# EAGLE board soundcard v1.1 (EAGLE 6.5.0), part 1 of 2
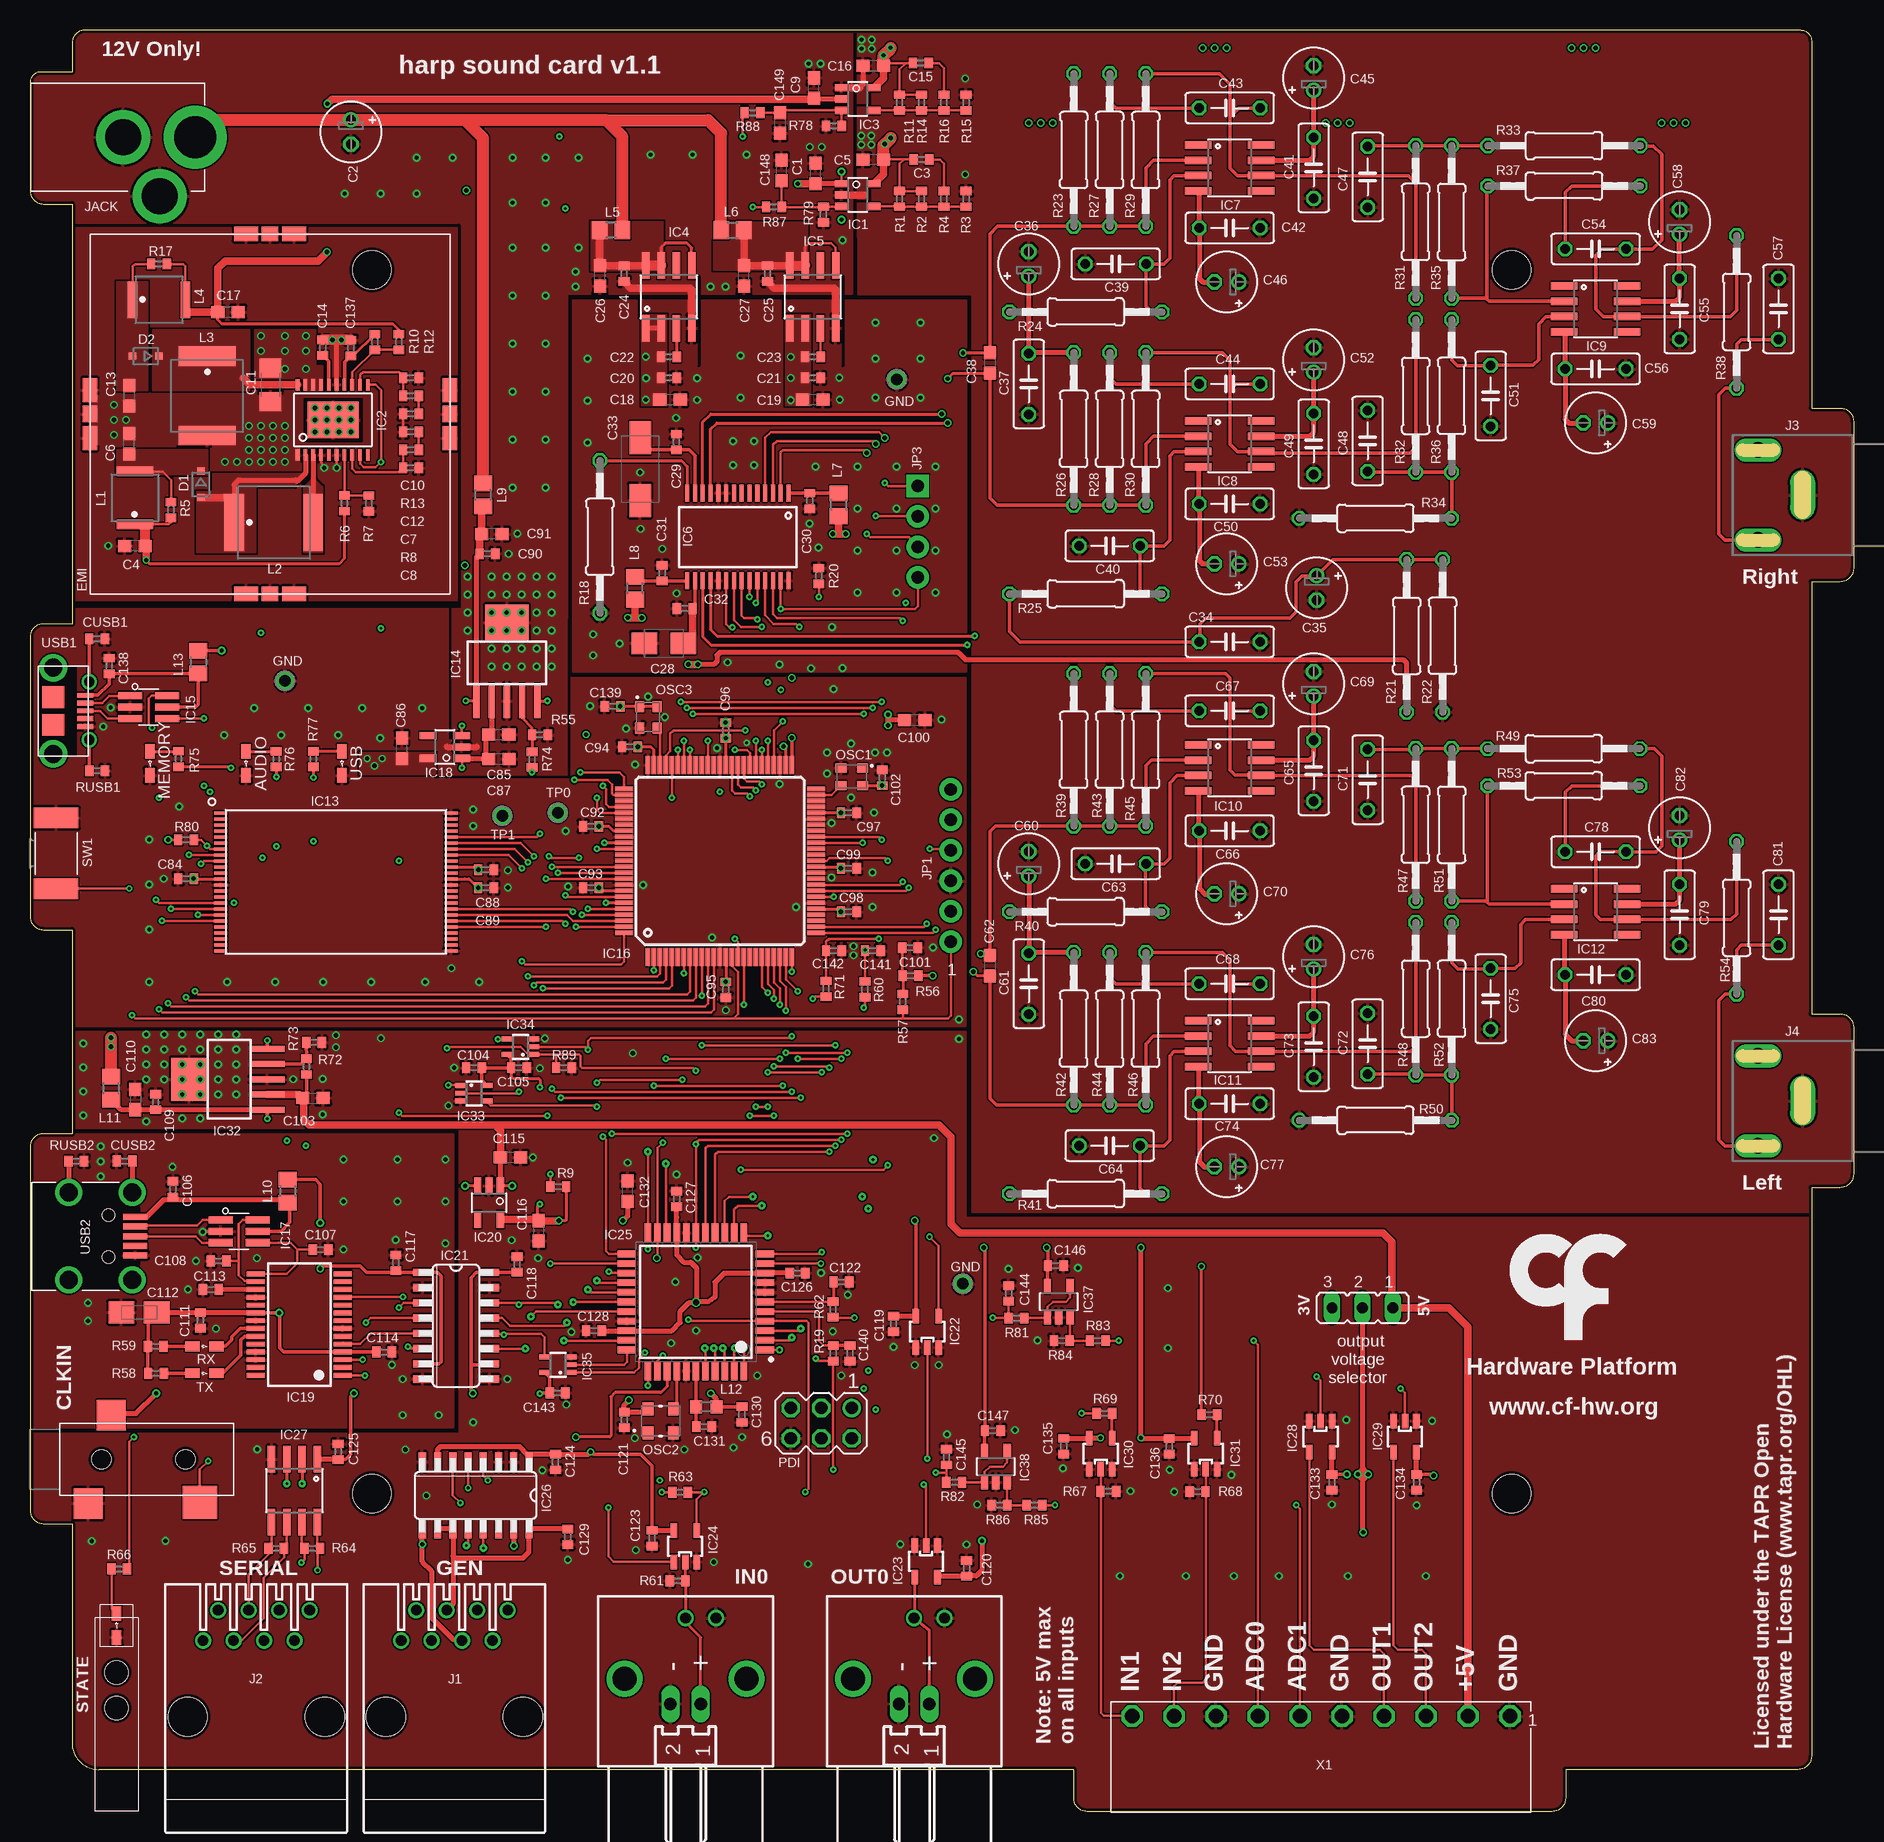
[diagram p8: board, top side]
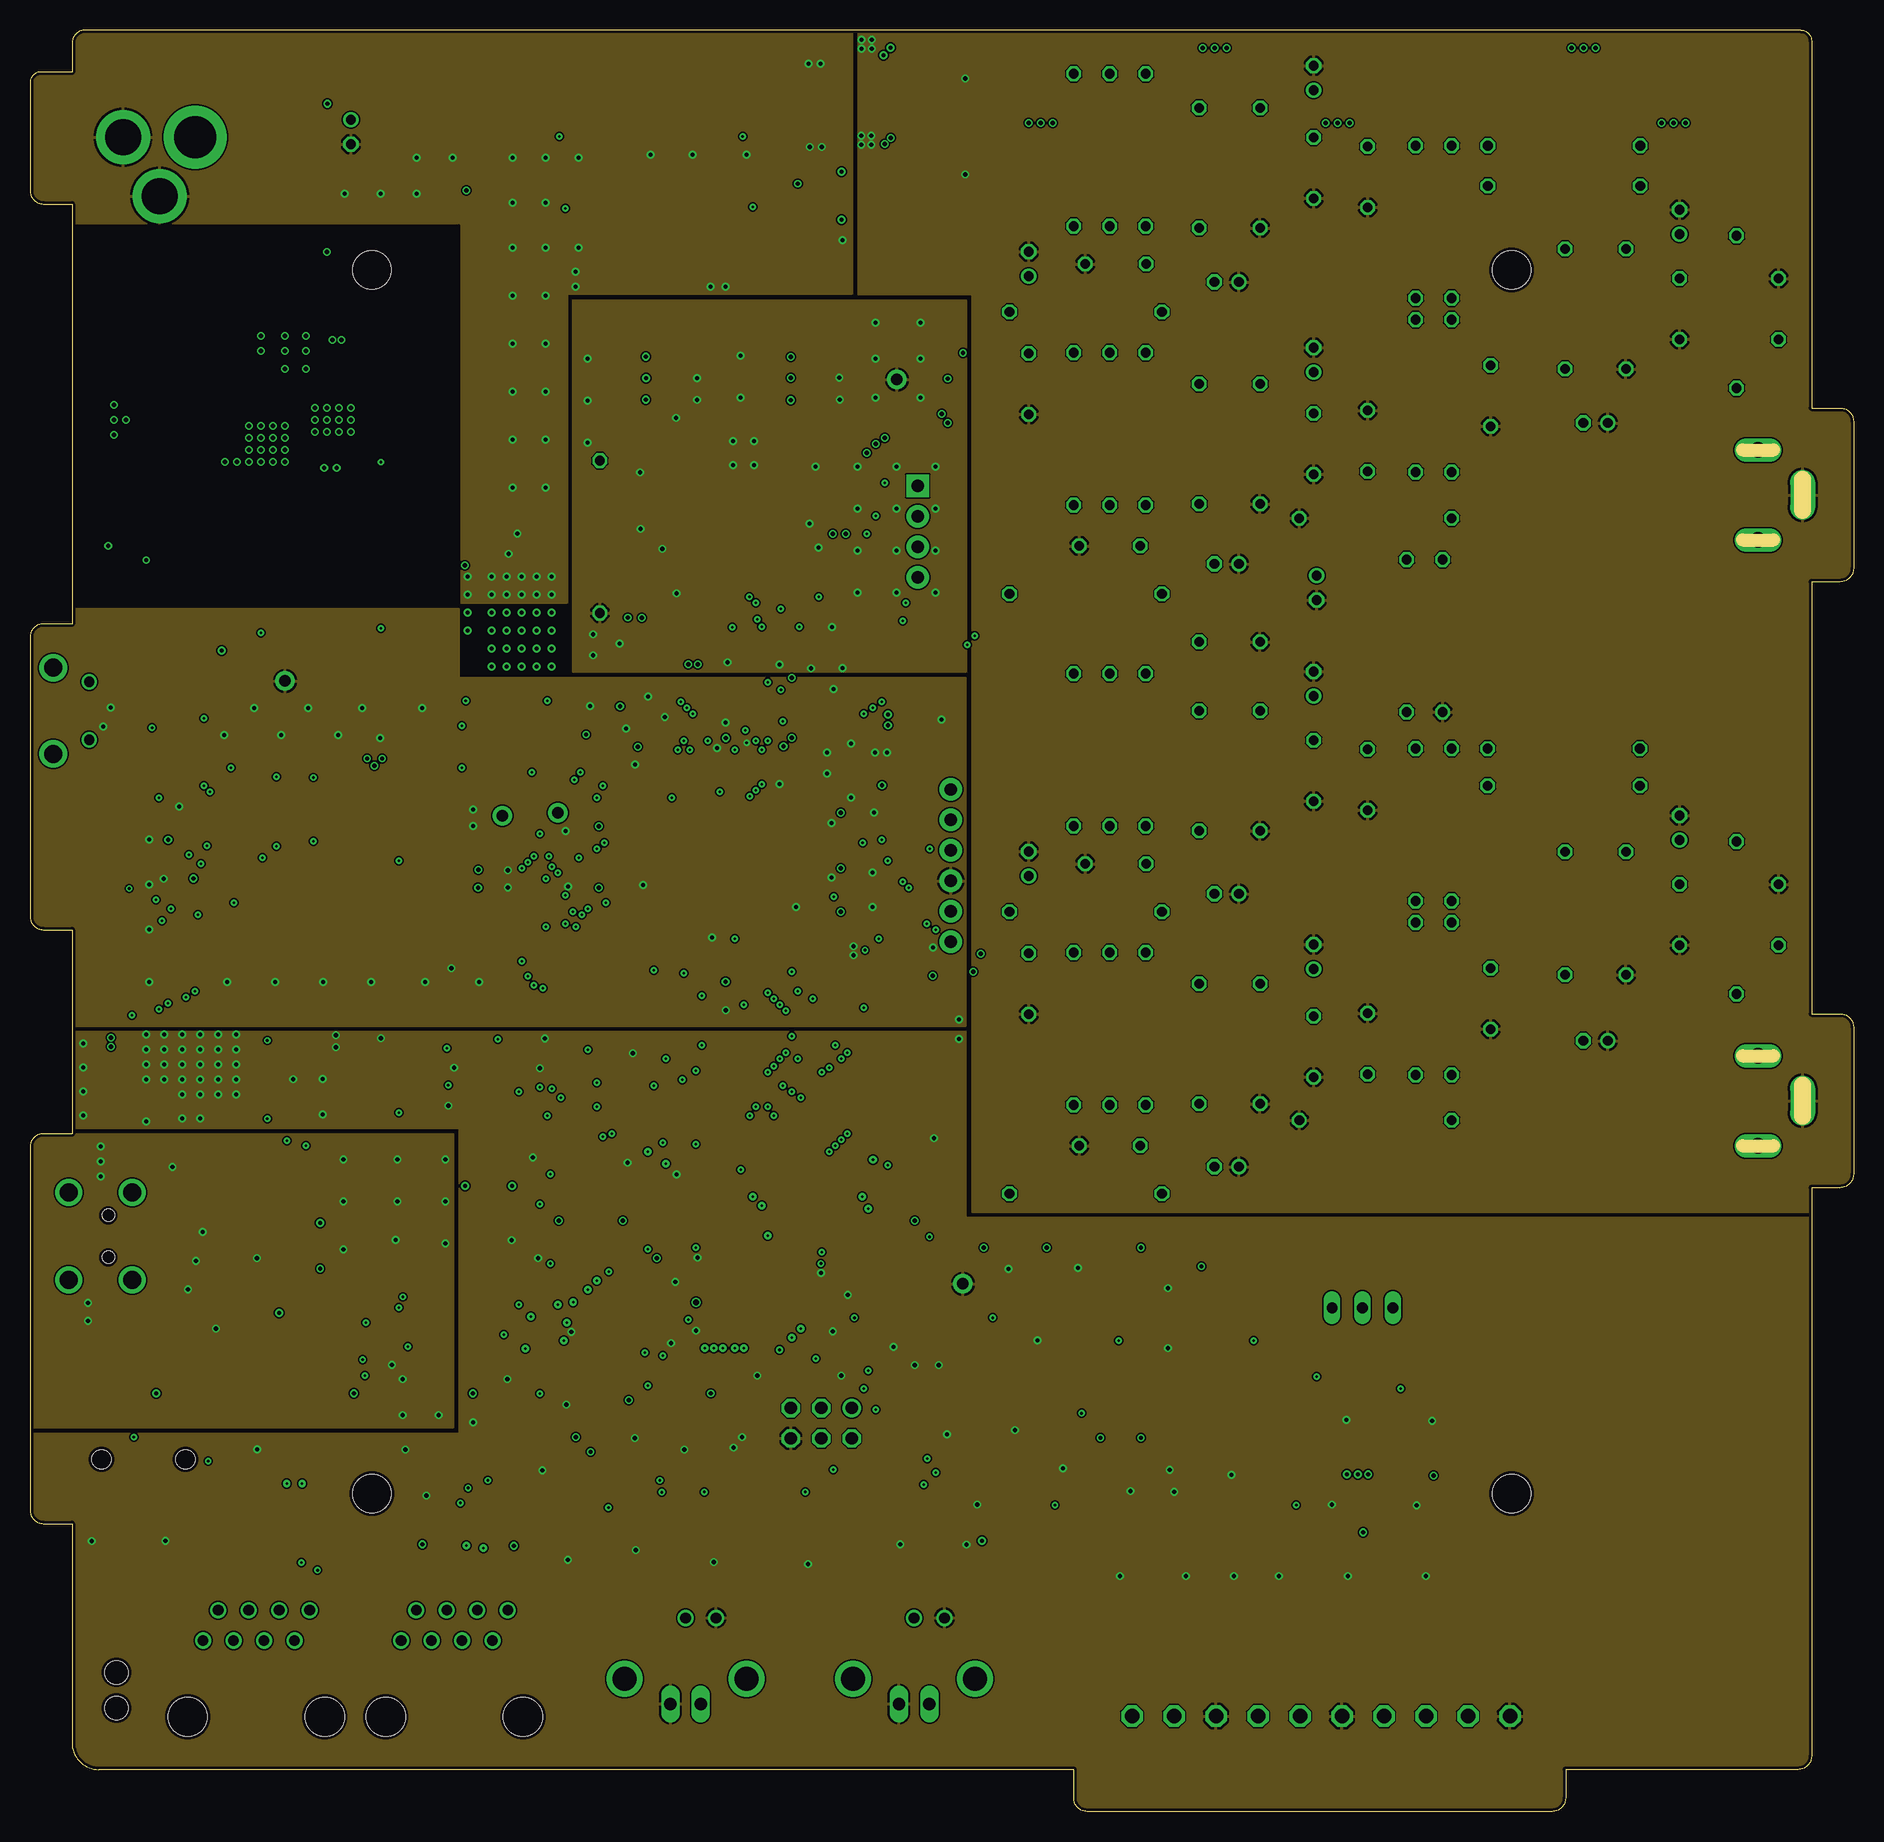
[diagram p9: board, inner layer Route2]
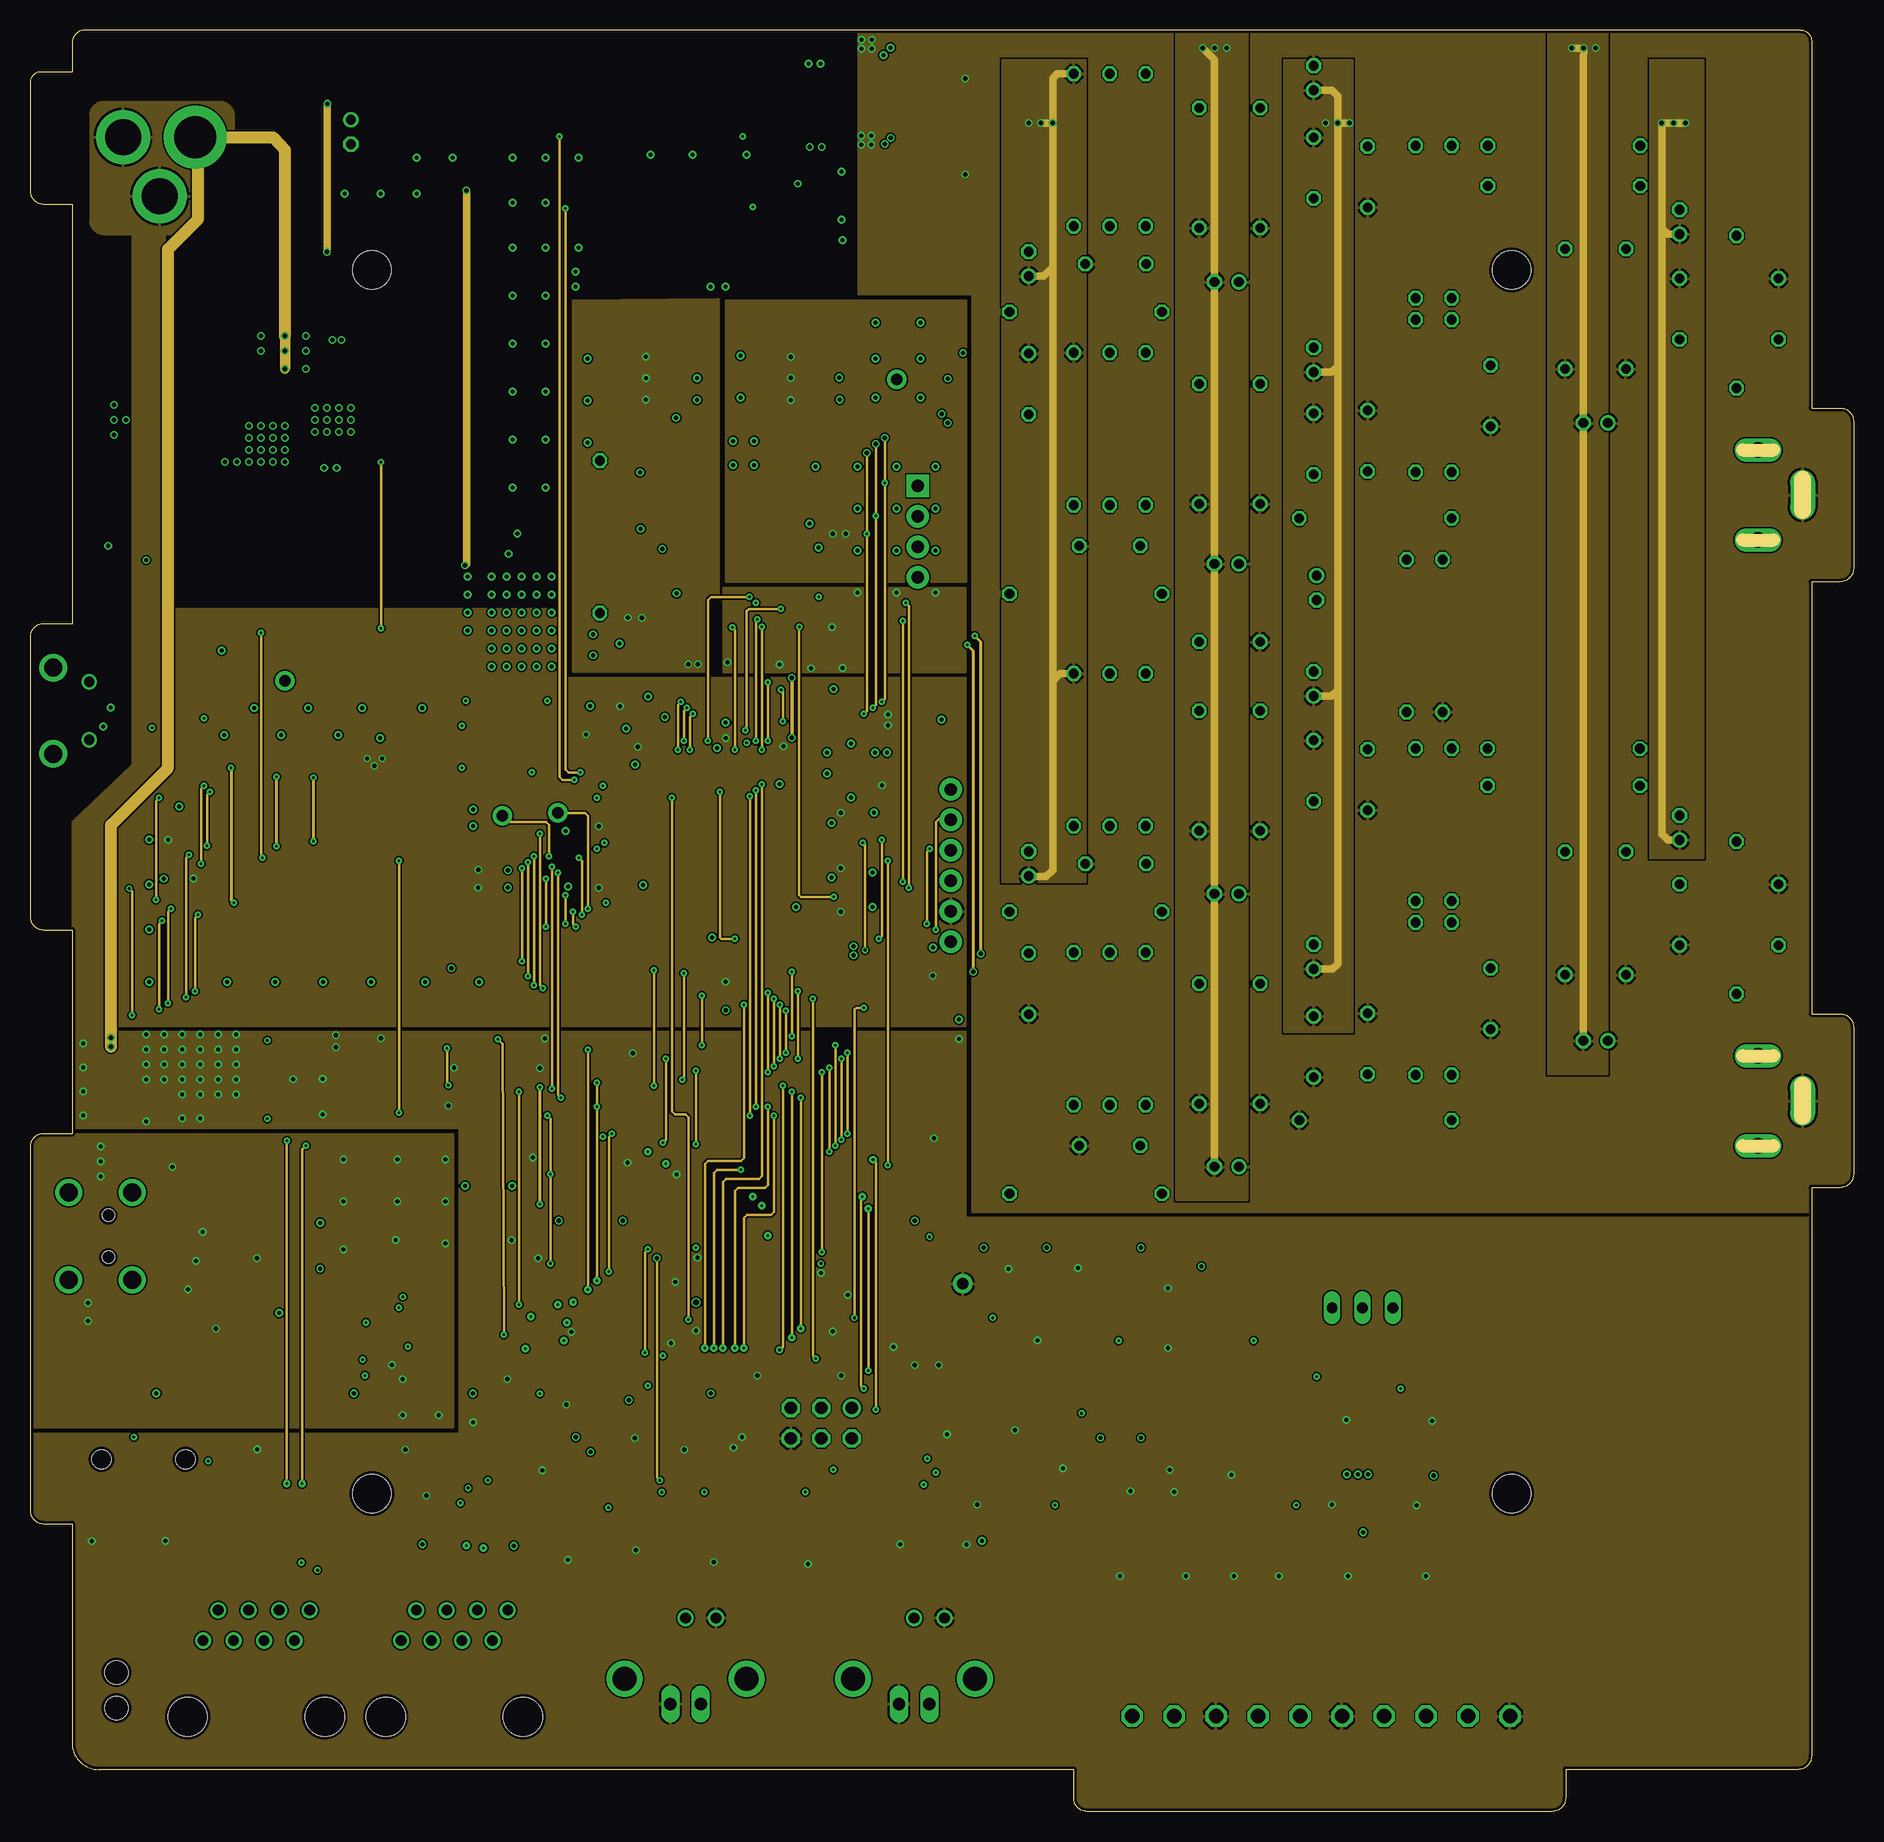
[diagram p10: board, inner layer Route3]
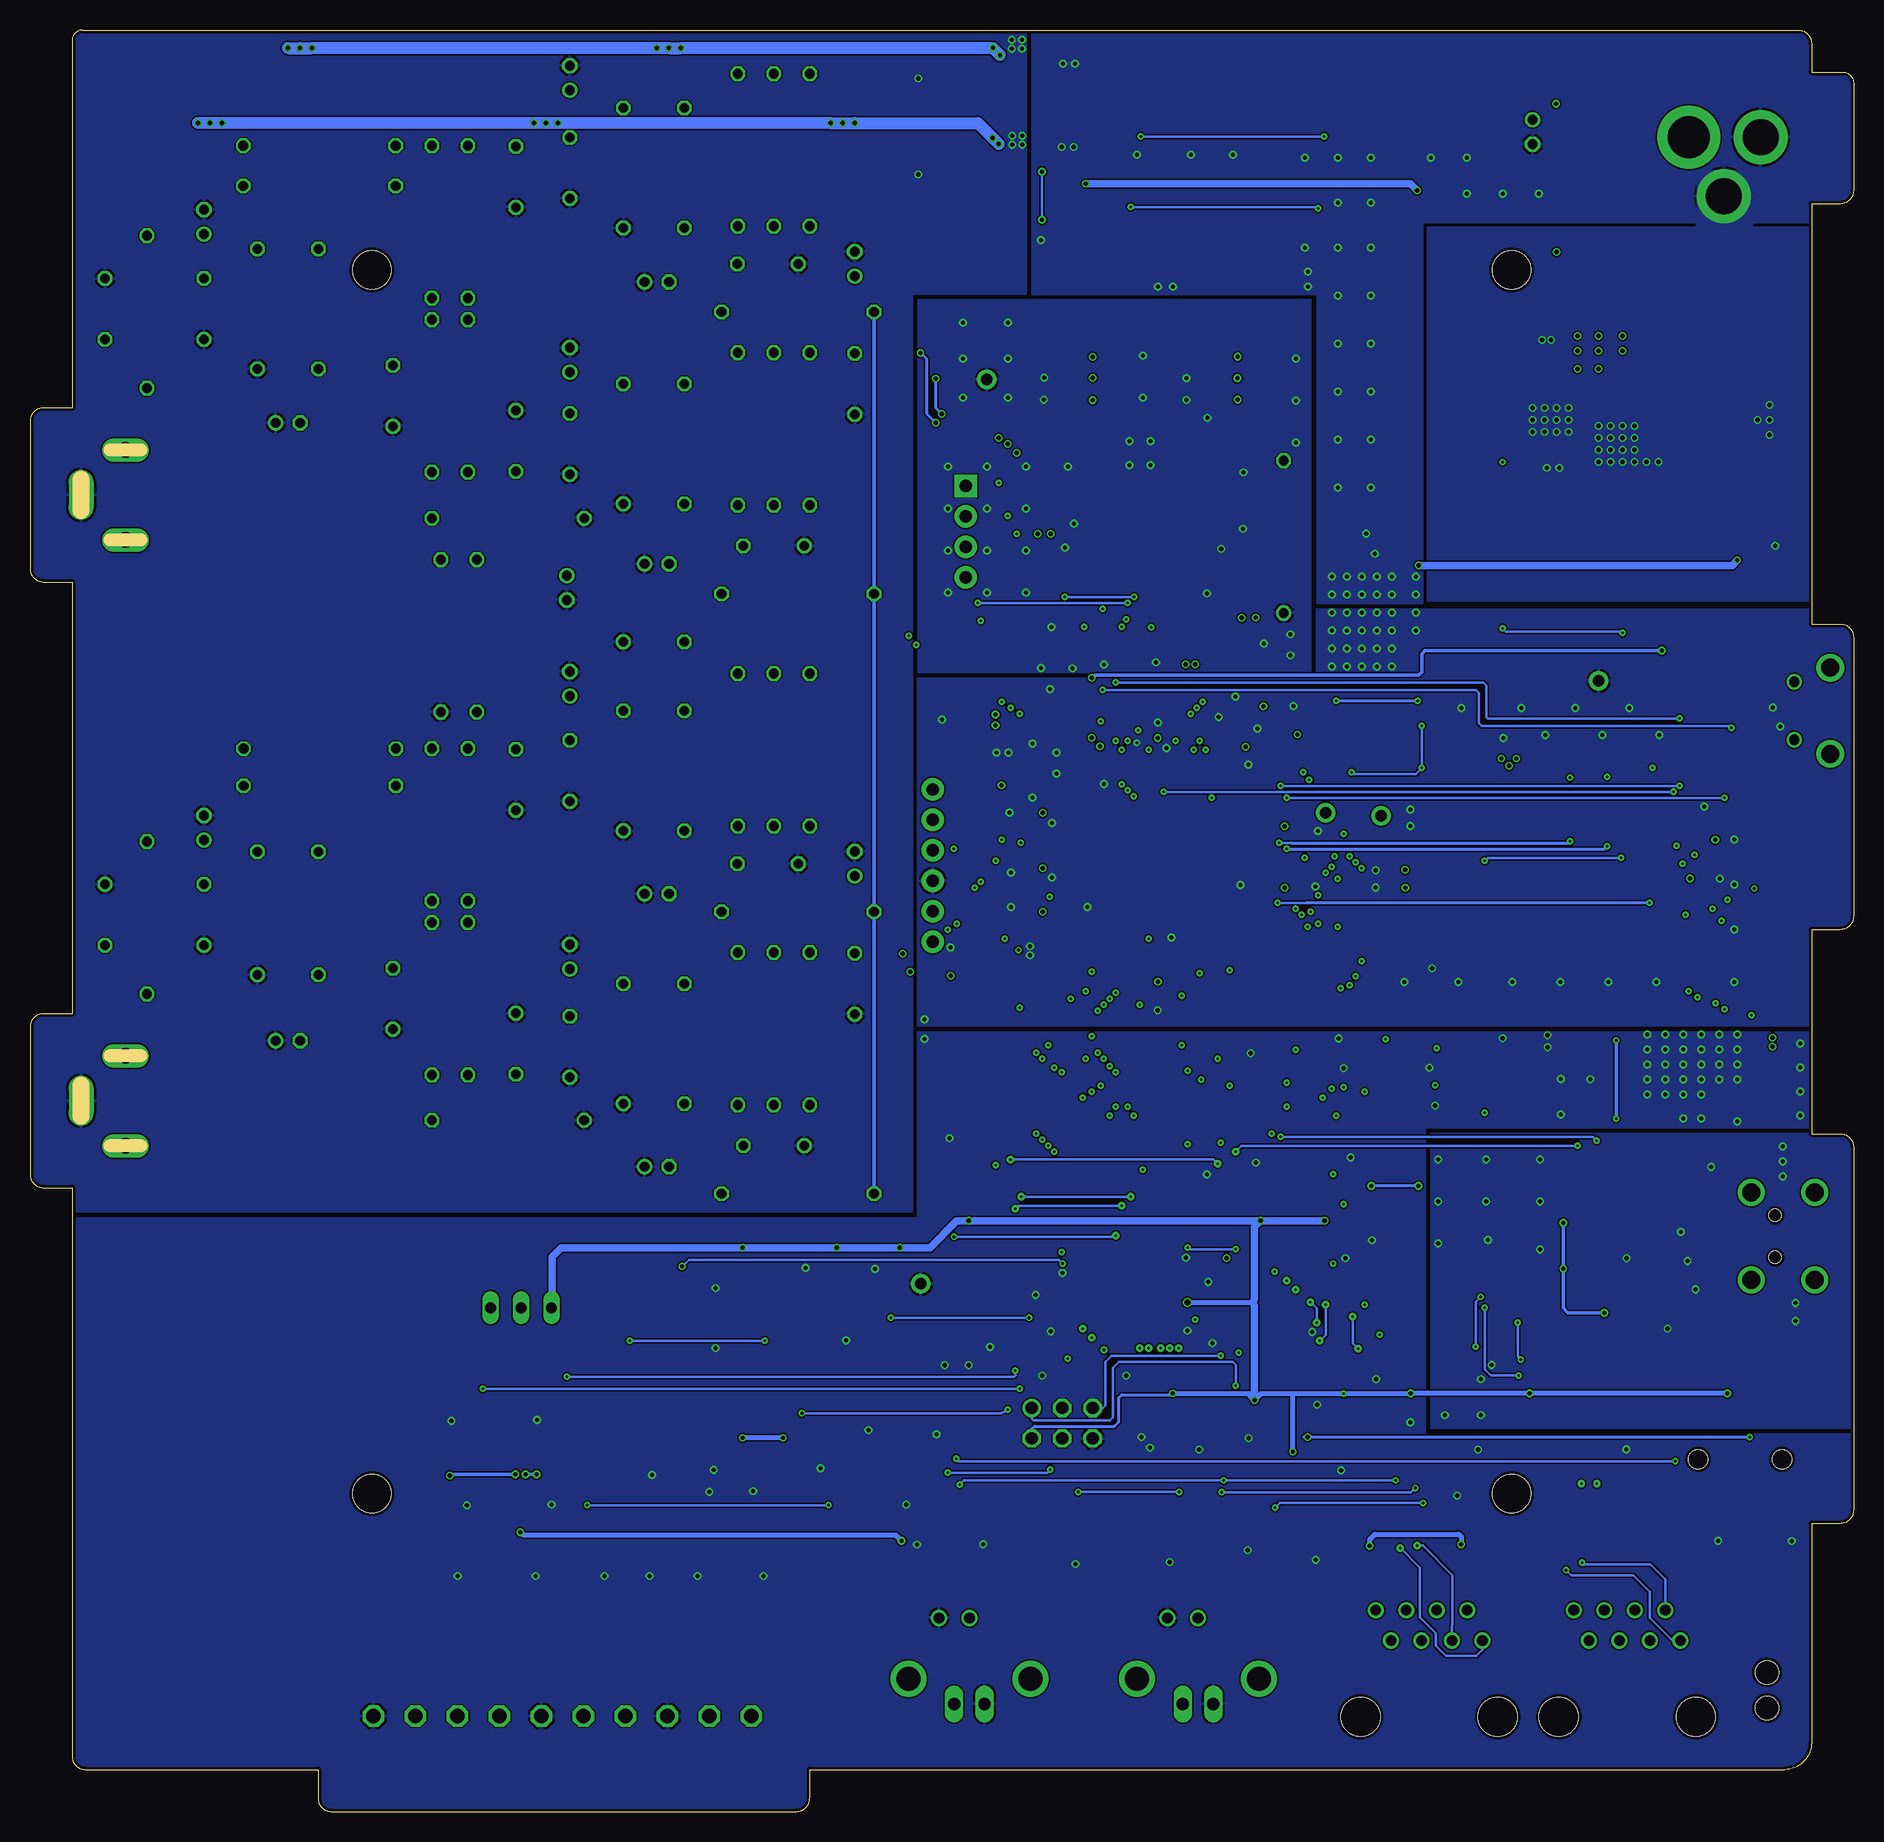
[diagram p11: board, bottom side, seen from below]

Size 152 x 148.5 mm. Coordinates in mm from the lower left corner, seen from the top.
Outline: 3.5,56.5 1.12,56.5 arc90 0,55.38 0,25.12 arc90 1.12,24 3.5,24 3.5,5.74 arc90 5.74,3.5 87,3.5 87,1.12 arc90 88.12,0 126.88,0 arc90 128,1.12 128,3.5 147.38,3.5 arc90 148.5,4.62 148.5,52 150.88,52 arc90 152,53.12 152,65.38 arc90 150.88,66.5 148.5,66.5 148.5,102.5 150.88,102.5 arc90 152,103.62 152,115.88 arc90 150.88,117 148.5,117 148.5,147.6 arc90 147.6,148.5 4.62,148.5 arc90 3.5,147.38 3.5,145 0.9,145 arc90 0,144.1 0,135.12 arc90 1.12,134 3.5,134 3.5,99 1.12,99 arc90 0,97.88 0,74.62 arc90 1.12,73.5 3.5,73.5 3.5,56.5
Copper layers (1+2*3+16): Top 0.018mm / dielectric 0.36mm / Route2 0.035mm / dielectric 0.71mm / Route3 0.035mm / dielectric 0.36mm / Bottom 0.018mm
Design rules "eC_4Layer_PClass7_BaseCopperO18-I35 *": minimum track width 0.125mm, minimum drill 0.15mm, track to track 0.125mm, track to pad 0.125mm, pad to pad 0.125mm, via to via 0.125mm, smd to smd 0mil, copper to edge 0.25mm, drill to drill 0.35mm, minimum pad ring 0.175mm, minimum via ring 0.125mm, stop-mask expansion 0mil, vias tented up to drill 0.45mm, thermal gap 0.2mm
Holes 3.2 mm at 28.5,26.5 123.5,26.5 28.5,128.5 123.5,128.5
tRestrict: 19 lines
bRestrict: 6 lines

## Footprints (pad centres in the part's own frame; a part is rotated, then mirrored left to right if it is on the bottom)
C0603 = smd 1.1 x 1: 1 -0.85,0; 2 0.85,0
E2-5 = drill 0.813 pad 1.27: + -1.016,0 | drill 0.813 pad 1.27 octagon: - 1.016,0
C0402 = smd 0.7 x 0.9: 1 -0.65,0; 2 0.65,0
C1206 = smd 1.6 x 1.8: 1 -1.4,0; 2 1.4,0
B/3528-21W = smd 2.15 x 1.8: + 1.625,0; - -1.625,0
C/6032-28W = smd 2.75 x 1.8: + 2.625,0; - -2.625,0
C050-025X075 = drill 0.813 octagon: 1 -2.54,0; 2 2.54,0
A/3216-18W = smd 2.15 x 1.8: + 1.475,0; - -1.475,0
35RASMT2BHNTRX = smd 2.4 x 2.55: 1 0.8,3.675; 5 -1.1,-3.675 | smd 2.9 x 2.75: 4 8.2,-3.575 | hole 1.6: 0,0; 7,0
SOD323-R = smd 0.6 x 0.6: A 1.1,0; C -1.1,0
S01-30300500 = smd 1.4 x 1.2: P$1 0,15; P$7 0,-15 | smd 1.2 x 1.4: P$2 -15,0; P$3 15,0 | smd 2 x 1.2: P$4 2,-15; P$5 -2,-15; P$6 2,15; P$8 -2,15 | smd 1.2 x 2: P$9 -15,2; P$10 -15,-2; P$11 15,2; P$12 15,-2
TP_1 = drill 0.925 pad 1.6: TP 0,0
TSOT23-5 = smd 0.6 x 1.05: 1 -0.95,-1.354; 2 0,-1.354; 3 0.95,-1.354; 4 0.95,1.354; 5 -0.95,1.354
TSSOP-EP-20 = smd 0.305 x 0.991: 1 -2.94,-2.918; 2 -2.29,-2.918; 3 -1.64,-2.918; 4 -0.99,-2.918; 5 -0.34,-2.918; 6 0.31,-2.918; 7 0.96,-2.918; 8 1.61,-2.918; 9 2.26,-2.918; 10 2.91,-2.918; 11 2.91,2.918; 12 2.26,2.918; 13 1.61,2.918; 14 0.96,2.918; 15 0.31,2.918; 16 -0.34,2.918; 17 -0.99,2.918; 18 -1.64,2.918; 19 -2.29,2.918; 20 -2.94,2.918 | smd 4.25 x 3.05: EPAD 0,0
SO08 = smd 0.61 x 2.21: 1 -1.905,-2.616; 2 -0.635,-2.616; 3 0.635,-2.616; 4 1.905,-2.616; 5 1.905,2.616; 6 0.635,2.616; 7 -0.635,2.616; 8 -1.905,2.616
SSOP28 = smd 0.348 x 1.397: P1 -4.225,-3.656; P2 -3.575,-3.656; P3 -2.925,-3.656; P4 -2.275,-3.656; P5 -1.625,-3.656; P6 -0.975,-3.656; P7 -0.325,-3.656; P8 0.325,-3.656; P9 0.975,-3.656; P10 1.625,-3.656; P11 2.275,-3.656; P12 2.925,-3.656; P13 3.575,-3.656; P14 4.225,-3.656; P15 4.225,3.656; P16 3.575,3.656; P17 2.925,3.656; P18 2.275,3.656; P19 1.625,3.656; P20 0.975,3.656; P21 0.325,3.656; P22 -0.325,3.656; P23 -0.975,3.656; P24 -1.625,3.656; P25 -2.275,3.656; P26 -2.925,3.656; P27 -3.575,3.656; P28 -4.225,3.656
TSOP-48 = smd 0.25 x 1.1: P1 -5.75,-9.6; P2 -5.25,-9.6; P3 -4.75,-9.6; P4 -4.25,-9.6; P5 -3.75,-9.6; P6 -3.25,-9.6; P7 -2.75,-9.6; P8 -2.25,-9.6; P9 -1.75,-9.6; P10 -1.25,-9.6; P11 -0.75,-9.6; P12 -0.25,-9.6; P13 0.25,-9.6; P14 0.75,-9.6; P15 1.25,-9.6; P16 1.75,-9.6; P17 2.25,-9.6; P18 2.75,-9.6; P19 3.25,-9.6; P20 3.75,-9.6; P21 4.25,-9.6; P22 4.75,-9.6; P23 5.25,-9.6; P24 5.75,-9.6; P25 5.75,9.6; P26 5.25,9.6; P27 4.75,9.6; P28 4.25,9.6; P29 3.75,9.6; P30 3.25,9.6; P31 2.75,9.6; P32 2.25,9.6; P33 1.75,9.6; P34 1.25,9.6; P35 0.75,9.6; P36 0.25,9.6; P37 -0.25,9.6; P38 -0.75,9.6; P39 -1.25,9.6; P40 -1.75,9.6; P41 -2.25,9.6; P42 -2.75,9.6; P43 -3.25,9.6; P44 -3.75,9.6; P45 -4.25,9.6; P46 -4.75,9.6; P47 -5.25,9.6; P48 -5.75,9.6
SOT223-6 = smd 0.508 x 2.87: P$1 -2.54,-3.175; P$2 -1.27,-3.175; P$3 0,-3.175; P$4 1.27,-3.175; P$5 2.54,-3.175 | smd 3.6 x 2.962: P$6 0,3.353
SOT23-6L = smd 0.6 x 2: P$1 -0.95,-1.55; P$2 0,-1.55; P$3 0.95,-1.55; P$4 0.95,1.55; P$5 0,1.55; P$6 -0.95,1.55
TQFP-100 = smd 1.5 x 0.35: 1 -8,6; 2 -8,5.5; 3 -8,5; 4 -8,4.5; 5 -8,4; 6 -8,3.5; 7 -8,3; 8 -8,2.5; 9 -8,2; 10 -8,1.5; 11 -8,1; 12 -8,0.5; 13 -8,0; 14 -8,-0.5; 15 -8,-1; 16 -8,-1.5; 17 -8,-2; 18 -8,-2.5; 19 -8,-3; 20 -8,-3.5; 21 -8,-4; 22 -8,-4.5; 23 -8,-5; 24 -8,-5.5; 25 -8,-6; 51 8,-6; 52 8,-5.5; 53 8,-5; 54 8,-4.5; 55 8,-4; 56 8,-3.5; 57 8,-3; 58 8,-2.5; 59 8,-2; 60 8,-1.5; 61 8,-1; 62 8,-0.5; 63 8,0; 64 8,0.5; 65 8,1; 66 8,1.5; 67 8,2; 68 8,2.5; 69 8,3; 70 8,3.5; 71 8,4; 72 8,4.5; 73 8,5; 74 8,5.5; 75 8,6 | smd 0.35 x 1.5: 26 -6,-8; 27 -5.5,-8; 28 -5,-8; 29 -4.5,-8; 30 -4,-8; 31 -3.5,-8; 32 -3,-8; 33 -2.5,-8; 34 -2,-8; 35 -1.5,-8; 36 -1,-8; 37 -0.5,-8; 38 0,-8; 39 0.5,-8; 40 1,-8; 41 1.5,-8; 42 2,-8; 43 2.5,-8; 44 3,-8; 45 3.5,-8; 46 4,-8; 47 4.5,-8; 48 5,-8; 49 5.5,-8; 50 6,-8; 76 6,8; 77 5.5,8; 78 5,8; 79 4.5,8; 80 4,8; 81 3.5,8; 82 3,8; 83 2.5,8; 84 2,8; 85 1.5,8; 86 1,8; 87 0.5,8; 88 0,8; 89 -0.5,8; 90 -1,8; 91 -1.5,8; 92 -2,8; 93 -2.5,8; 94 -3,8; 95 -3.5,8; 96 -4,8; 97 -4.5,8; 98 -5,8; 99 -5.5,8; 100 -6,8
TSOT23-5' = smd 0.6 x 1.408: 1 -0.95,-1.404; 2 0,-1.404; 3 0.95,-1.404; 4 0.95,1.404; 5 -0.95,1.404
SSOP28' = smd 0.4 x 1.5: 1 -4.225,-3.625; 2 -3.575,-3.625; 3 -2.925,-3.625; 4 -2.275,-3.625; 5 -1.625,-3.625; 6 -0.975,-3.625; 7 -0.325,-3.625; 8 0.325,-3.625; 9 0.975,-3.625; 10 1.625,-3.625; 11 2.275,-3.625; 12 2.925,-3.625; 13 3.575,-3.625; 14 4.225,-3.625; 15 4.225,3.625; 16 3.575,3.625; 17 2.925,3.625; 18 2.275,3.625; 19 1.625,3.625; 20 0.975,3.625; 21 0.325,3.625; 22 -0.325,3.625; 23 -0.975,3.625; 24 -1.625,3.625; 25 -2.275,3.625; 26 -2.925,3.625; 27 -3.575,3.625; 28 -4.225,3.625
NSOIC-16 = smd 0.6 x 1.55: 1 -4.437,-2.789; 2 -3.167,-2.789; 3 -1.897,-2.789; 4 -0.627,-2.789; 5 0.643,-2.789; 6 1.913,-2.789; 7 3.183,-2.789; 8 4.453,-2.789; 9 4.453,2.811; 10 3.183,2.811; 11 1.913,2.811; 12 0.643,2.811; 13 -0.627,2.811; 14 -1.897,2.811; 15 -3.167,2.811; 16 -4.437,2.811
SOT23-5 = smd 0.55 x 1.2: 1 -0.95,-1.3; 2 0,-1.3; 3 0.95,-1.3; 4 0.95,1.3; 5 -0.95,1.3
QFP80P1200X1200X120-44N = smd 1.55 x 0.55: 1 -5.75,4; 2 -5.75,3.2; 3 -5.75,2.4; 4 -5.75,1.6; 5 -5.75,0.8; 6 -5.75,0; 7 -5.75,-0.8; 8 -5.75,-1.6; 9 -5.75,-2.4; 10 -5.75,-3.2; 11 -5.75,-4; 23 5.75,-4; 24 5.75,-3.2; 25 5.75,-2.4; 26 5.75,-1.6; 27 5.75,-0.8; 28 5.75,0; 29 5.75,0.8; 30 5.75,1.6; 31 5.75,2.4; 32 5.75,3.2; 33 5.75,4 | smd 0.55 x 1.55: 12 -4,-5.75; 13 -3.2,-5.75; 14 -2.4,-5.75; 15 -1.6,-5.75; 16 -0.8,-5.75; 17 0,-5.75; 18 0.8,-5.75; 19 1.6,-5.75; 20 2.4,-5.75; 21 3.2,-5.75; 22 4,-5.75; 34 4,5.75; 35 3.2,5.75; 36 2.4,5.75; 37 1.6,5.75; 38 0.8,5.75; 39 0,5.75; 40 -0.8,5.75; 41 -1.6,5.75; 42 -2.4,5.75; 43 -3.2,5.75; 44 -4,5.75
SC-70-5 = smd 0.4 x 0.9: 1 -0.65,-1.1; 2 0,-1.1; 3 0.65,-1.1; 4 0.65,1.1; 5 -0.65,1.1
SOT23-5' = smd 0.6 x 1.2: 1 -0.95,-1.306; 2 0,-1.306; 3 0.95,-1.306; 4 0.95,1.306; 5 -0.95,1.306
BNC_RA = drill 0.9 pad 1.27: 1 0,-5.08; 2 -2.54,-5.08 | drill 2: P$1 -5.08,0; P$2 5.08,0
7395-02 = drill 1.016 long: 1 1.27,0; 2 -1.27,0
520426-4 = drill 0.889: 1 -4.445,6.35; 2 -3.175,8.89; 3 -1.905,6.35; 4 -0.635,8.89; 5 0.635,6.35; 6 1.905,8.89; 7 3.175,6.35; 8 4.445,8.89 | hole 3.251: -5.715,0; 5.715,0
RCA = drill 1.4 long: P1 0,0 | drill 1.3 long: P2 3.7,3.75; P3 3.7,-3.75
DC_POWER_INPUT_2.1MM = drill 3.5: P1 8.5,0 | drill 3: P2 2.5,0; P3 5.55,-4.9
1X06_NO_SILK = drill 1.016 pad 1.88: 1 0,0; 2 2.54,0; 3 5.08,0; 4 7.62,0; 5 10.16,0; 6 12.7,0
JP2 = drill 0.914 long: 1 -2.54,0; 2 0,0; 3 2.54,0
1X04_NO_SILK = drill 1.016 pad 1.88 square: 1 0,0 | drill 1.016 pad 1.88: 2 2.54,0; 3 5.08,0; 4 7.62,0
IND_LPS4012 = smd 0.81 x 3.04: 1 -2.2,0; 2 2.2,0
IND_LPS6225 = smd 1.675 x 4.75: 1 -3.3,0 | smd 1.575 x 4.75: 2 3.3,0
R0805 = smd 1.3 x 1.5: 1 -0.95,0; 2 0.95,0
R0603 = smd 1 x 1.1: 1 -0.85,0; 2 0.85,0
LED_HAND = smd 1.2 x 0.8: A -1,0; K 1,0
CRYSTAL_2.5X2.0MM = smd 0.9 x 0.75: P$1 -0.9,-0.725; P$2 0.9,-0.725; P$3 0.9,0.725; P$4 -0.9,0.725
OSCILLATOR_3.2X2.5 = smd 0.9 x 1.1: P$1 -1.05,-1; P$2 1.05,-1; P$3 1.05,1; P$4 -1.05,1
MA03-2 = drill 1.016: 1 -2.54,-1.27 | drill 1.016 octagon: 2 -2.54,1.27; 3 0,-1.27; 4 0,1.27; 5 2.54,-1.27; 6 2.54,1.27
R0402 = smd 0.7 x 0.9: 1 -0.65,0; 2 0.65,0
0207/12 = drill 0.813 octagon: 1 -6.35,0; 2 6.35,0
SWITCH_KSS = smd 1.7 x 3.7: O -2.95,0; P 2.95,0
LED_PIPE_7513D2-L = hole 1.93: -1.486,0; 1.486,0
ZX62D-B-5P8 = smd 0.4 x 1.35: P$1 -1.3,2.675; P$2 -0.65,2.675; P$3 0,2.675; P$4 0.65,2.675; P$5 1.3,2.675 | smd 1.8 x 1.8: P$6 -1.15,0; P$7 1.15,0 | drill 1.5 pad 2.3: SHIELD_1 -3.6,0; SHIELD_2 3.6,0 | drill 0.85 pad 1.25: SHIELD_3 2.425,3; SHIELD_4 -2.425,3
240-0002-1 = smd 0.5 x 2: P$1 -1.6,8.65; P$2 -0.8,8.65; P$3 0,8.65; P$4 0.8,8.65; P$5 1.6,8.65 | drill 1.5: SHIELD_1 -3.65,3.1; SHIELD_2 3.65,3.1; SHIELD_3 3.65,8.4; SHIELD_4 -3.65,8.4 | hole 1: -1.75,6.4; 1.75,6.4
CON_3.5MM_1X10 = drill 1.2 octagon: P1 -15.75,0; P2 -12.25,0; P3 -8.75,0; P4 -5.25,0; P5 -1.75,0; P6 1.75,0; P7 5.25,0; P8 8.75,0; P9 12.25,0; P10 15.75,0

## Placement (x,y rotation side)
C1  2.2u  [C0603]  65.49,136.55 90 top
C2  68uF  [E2-5]  26.75,140 270 top
C3  1u  [C0402]  74.3,137.7 180 top
C4  1u  [C0603]  8.75,105.5 180 top
C5  2.2u  [C0603]  70.3,137.7 180 top
C6  1u  [C0603]  8.25,114 90 top
C7  820p  [C0402]  31.75,115 180 top
C8  47p  [C0402]  31.75,112 0 top
C9  2.2u  [C0603]  65.34,143.65 90 top
C10  68p  [C0402]  31.75,119.5 0 top
C11  10u  [C1206]  20.05,118.92 270 top
C12  6.8n  [C0402]  31.75,116.5 180 top
C13  1u  [C0603]  8.25,118 270 top
C14  1u  [C0402]  24.41,122.03 90 top
C15  100n  [C0402]  74.25,145.75 180 top
C16  2.2u  [C0603]  70.3,145.51 180 top
C17  1u  [C0603]  16.51,124.99 0 top
C18  10uF  [C0603]  53.35,117.68 180 top
C19  10uF  [C0603]  65.25,117.68 180 top
C20  100nF  [C0402]  53.25,119.5 180 top
C21  100nF  [C0402]  65.25,119.5 180 top
C22  10nF  [C0402]  53.25,121.25 180 top
C23  10nF  [C0402]  65.25,121.25 180 top
C24  100nF  [C0402]  49.52,128.2 90 top
C25  100nF  [C0402]  61.47,128.2 90 top
C26  10uF  [C0603]  47.5,128 90 top
C27  10uF  [C0603]  59.5,128 90 top
C28  10u  [B/3528-21W]  52.84,97.38 0 top
C29  100nF  [C0402]  53.88,114.16 90 top
C30  100nF  [C0402]  65,109.25 270 top
C31  100nF  [C0402]  52.7,103.23 90 top
C32  100nF  [C0402]  54.58,100.28 180 top
C33  47u  [C/6032-28W]  50.86,111.9 90 top
C34  100nF  [C050-025X075]  100,97.5 0 top
C35  47uF  [E2-5]  107.25,102 270 top
C36  4.7uF  [E2-5]  83.25,129 90 top
C37  100nF  [C050-025X075]  83.25,119 270 top
C38  100pF  [C0603]  80,120.75 270 top
C39  100nF  [C050-025X075]  90.5,129 180 top
C40  100nF  [C050-025X075]  90,105.5 180 top
C41  100nF  [C050-025X075]  107,137 270 top
C42  100nF  [C050-025X075]  100,132 180 top
C43  100pF  [C050-025X075]  100,142 0 top
C44  100pF  [C050-025X075]  100,119 0 top
C45  4.7uF  [E2-5]  107,144.5 90 top
C46  4.7uF  [E2-5]  99.75,127.5 180 top
C47  5.6nF  [C050-025X075]  111.5,136.25 270 top
C48  5.6nF  [C050-025X075]  111.5,114.25 90 top
C49  100nF  [C050-025X075]  107,114 270 top
C50  100nF  [C050-025X075]  100,109 180 top
C51  2.7nF  [C050-025X075]  121.75,118 270 top
C52  4.7uF  [E2-5]  107,121 90 top
C53  4.7uF  [E2-5]  99.75,104 180 top
C54  2.7nF  [C050-025X075]  130.5,130.25 0 top
C55  100nF  [C050-025X075]  137.5,125.25 270 top
C56  100nF  [C050-025X075]  130.5,120.25 180 top
C57  3.9nF  [C050-025X075]  145.75,125.25 90 top
C58  4.7uF  [E2-5]  137.5,132.5 90 top
C59  4.7uF  [E2-5]  130.5,115.75 180 top
C60  4.7uF  [E2-5]  83.25,79 90 top
C61  100nF  [C050-025X075]  83.25,69 270 top
C62  100pF  [C0603]  80,70.5 270 top
C63  100nF  [C050-025X075]  90.5,79 180 top
C64  100nF  [C050-025X075]  90,55.5 180 top
C65  100nF  [C050-025X075]  107,86.75 270 top
C66  100nF  [C050-025X075]  100,81.75 180 top
C67  100pF  [C050-025X075]  100,91.75 0 top
C68  100pF  [C050-025X075]  100,69 0 top
C69  4.7uF  [E2-5]  107,94 90 top
C70  4.7uF  [E2-5]  99.75,76.5 180 top
C71  5.6nF  [C050-025X075]  111.5,86 270 top
C72  5.6nF  [C050-025X075]  111.5,64 90 top
C73  100nF  [C050-025X075]  107,63.75 270 top
C74  100nF  [C050-025X075]  100,59 180 top
C75  2.7nF  [C050-025X075]  121.75,67.75 270 top
C76  4.7uF  [E2-5]  107,71.25 90 top
C77  4.7uF  [E2-5]  99.75,53.75 180 top
C78  2.7nF  [C050-025X075]  130.5,80 0 top
C79  100nF  [C050-025X075]  137.5,74.75 270 top
C80  100nF  [C050-025X075]  130.5,69.75 180 top
C81  3.9nF  [C050-025X075]  145.75,74.75 90 top
C82  4.7uF  [E2-5]  137.5,82 90 top
C83  4.7uF  [E2-5]  130.5,64.25 180 top
C84  100nF  [C0402]  13,77.75 180 top
C85  10uF  [C0603]  39.07,89.77 0 top
C86  10uF  [C0603]  31.02,88.63 90 top
C87  10uF  [C0603]  39.08,87.74 0 top
C88  100nF  [C0402]  38,78.5 0 top
C89  100nF  [C0402]  38,77 0 top
C90  100nF  [C0402]  38.13,104.84 180 top
C91  10uF  [C0603]  38.5,106.5 180 top
C92  100nF  [C0402]  46.75,82.12 180 top
C93  100nF  [C0402]  46.75,77 180 top
C94  100nF  [C0402]  50,88.75 180 top
C95  100nF  [C0402]  58,68.5 270 top
C96  100nF  [C0402]  58,90.12 90 top
C97  100nF  [C0402]  68.25,83.25 0 top
C98  100nF  [C0402]  68.25,75 0 top
C99  100nF  [C0402]  68.25,78.62 0 top
C100  10uF  [C0603]  73.75,91 0 top
C101  100nF  [C0402]  73.36,72.01 0 top
C102  100nF  [C0402]  71.05,86.17 90 top
C103  10uF  [C0603]  23.59,59.46 0 top
C104  100nF  [C0402]  37,62 180 top
C105  100nF  [C0402]  40.75,62 0 top
C106  100nF  [C0402]  11.92,51.88 90 top
C107  47pF  [C0402]  24.22,46.84 0 top
C108  47pF  [C0402]  15.71,45.9 180 top
C109  100nF  [C0402]  10.48,59.14 270 top
C110  10uF  [C0603]  8.78,59.35 270 top
C111  100nF  [C0402]  14.21,40.93 270 top
C112  4.7uF  [A/3216-18W]  9.09,41.61 0 top
C113  100nF  [C0402]  15.08,43.51 180 top
C114  100nF  [C0402]  29.53,38.3 0 top
C115  10uF  [C0603]  40.05,54.54 0 top
C116  10uF  [C0603]  42.39,48.41 270 top
C117  100nF  [C0402]  30.5,45.75 90 top
C118  100nF  [C0402]  40.61,45.59 90 top
C119  100nF  [C0402]  71.97,40.64 270 top
C120  100nF  [C0402]  78.07,20.27 90 top
C121  100nF  [C0402]  49.54,32.64 270 top
C122  100nF  [C0402]  67.63,44.14 0 top
C123  100nF  [C0402]  51.85,22.79 270 top
C124  100nF  [C0402]  43.8,29.13 270 top
C125  100nF  [C0402]  25.7,29.99 90 top
C126  100nF  [C0402]  63.97,44.88 0 top
C127  100nF  [C0402]  53.9,51.07 90 top
C128  100nF  [C0402]  47.01,40.08 180 top
C129  100nF  [C0402]  44.83,22.91 270 top
C130  330nF  [C0402]  59.35,33.09 270 top
C131  330nF  [C0402]  56.19,32.09 0 top
C132  10uF  [C0603]  49.82,51.7 90 top
C133  100nF  [C0402]  108.52,27.44 270 top
C134  100nF  [C0402]  115.58,27.44 270 top
C135  100nF  [C0402]  86.16,30.46 270 top
C136  100nF  [C0402]  94.96,30.43 270 top
C137  1u  [C0402]  26.75,122 90 top
C138  100nF  [C0402]  6.6,95.5 90 top
C139  100nF  [C0402]  48.55,92.12 180 top
C140  100nF  [C0402]  68.35,38.19 270 top
C141  100nF  [C0402]  70.25,71.75 0 top
C142  100nF  [C0402]  67,71.75 0 top
C143  100nF  [C0402]  43.98,34.89 0 top
C144  15nF  [C0402]  81.58,43.19 270 top
C145  15nF  [C0402]  76.4,29.55 270 top
C146  100nF  [C0402]  85.5,45.5 0 top
C147  100nF  [C0402]  80.25,31.75 0 top
C148  1u  [C0603]  62.65,136.79 90 top
C149  1u  [C0603]  62.5,140.75 270 top
CLKIN  [35RASMT2BHNTRX]  5.96,29.36 0 top
CUSB1  4.7nF  [C0402]  5.59,97.74 0 top
CUSB2  4.7nF  [C0402]  7.88,54.22 180 top
D1  [SOD323-R]  14.25,110.62 270 top
D2  [SOD323-R]  9.65,121.31 180 top
EMI  S01-30300500  [S01-30300500]  20,116.5 90 top
GND  TP  [TP_1]  72.25,119.38 0 top
GND174  TP  [TP_1]  77.75,44 0 top
GND176  TP  [TP_1]  21.25,94.25 0 top
IC1  ADP7118  [TSOT23-5]  69,134.75 270 top
IC2  ADP5070EP  [TSSOP-EP-20]  25.25,116 0 top
IC3  ADP7182  [TSOT23-5]  69,142.75 270 top
IC4  ADP3303  [SO08]  53.25,126.25 0 top
IC5  ADP3303  [SO08]  65.25,126.25 0 top
IC6  AD1955  [SSOP28]  59,106.25 180 top
IC7  AD797  [SO08]  100,137 270 top
IC8  AD797  [SO08]  100,114 270 top
IC9  AD797  [SO08]  130.5,125.25 270 top
IC10  AD797  [SO08]  100,87 270 top
IC11  AD797  [SO08]  100,64 270 top
IC12  AD797  [SO08]  130.5,75 270 top
IC13  S34ML  [TSOP-48]  25.5,77.5 270 top
IC14  TPS73801  [SOT223-6]  39.75,95.75 0 top
IC15  USBLC6-2SC6  [SOT23-6L]  9.9,92.06 270 top
IC16  PIC32MZ2048EFM100  [TQFP-100]  57.5,79.25 90 top
IC17  USBLC6-2SC6  [SOT23-6L]  17.44,48.36 270 top
IC18  LP5907MFX-3.3  [TSOT23-5']  34.58,88.73 90 top
IC19  FT232RL  [SSOP28']  22.45,40.59 90 top
IC20  LP5907MFX-3.3  [TSOT23-5']  38.27,50.74 180 top
IC21  SI8642BC-B-IS1  [NSOIC-16]  35.5,40.5 270 top
IC22  SN74LVC1G125  [SOT23-5]  74.79,39.98 0 top
IC23  SN74LVC1G125  [SOT23-5]  74.7,20.86 180 top
IC24  SN74LVC1G125  [SOT23-5]  54.62,22.11 0 top
IC25  ATXMEGAxxxA4U-AU  [QFP80P1200X1200X120-44N]  55.5,42.48 180 top
IC26  SI8645  [NSOIC-16]  37.16,26.36 180 top
IC27  SN65HVD  [SO08]  22.04,26.74 180 top
IC28  M74VHC1GT50DTT1G  [SOT23-5]  107.58,31.25 180 top
IC29  M74VHC1GT50DTT1G  [SOT23-5]  114.61,31.25 180 top
IC30  SN74LVC1G125  [SOT23-5]  89.25,29.83 0 top
IC31  SN74LVC1G125  [SOT23-5]  98,29.83 0 top
IC32  TPS73801  [SOT223-6]  16.61,61.03 90 top
IC33  VHC1GT126  [SC-70-5]  37,59.88 270 top
IC34  VHC1GT126  [SC-70-5]  40.88,63.75 90 top
IC35  VHC1GT125  [SC-70-5]  44,37.25 90 top
IC37  OPA365  [SOT23-5']  85.75,42.5 0 top
IC38  OPA365  [SOT23-5']  80.5,28.75 0 top
IN  BNC  [BNC_RA]  54.65,11.05 180 top
IN1  [7395-02]  54.65,8.96 0 top
J1  Port 1  [520426-4]  35.38,7.9 0 top
J2  Port 1  [520426-4]  18.87,7.9 0 top
J3  RCARCA  [RCA]  147.75,109.75 180 top
J4  RCARCA  [RCA]  147.75,59.25 180 top
JACK  DC_JACK2.1MM  [DC_POWER_INPUT_2.1MM]  5.25,139.55 0 top
JP1  [1X06_NO_SILK]  76.75,72.5 90 top
JP2  [JP2]  111.08,41.98 180 top
JP3  NA  [1X04_NO_SILK]  74,110.5 270 top
L1  1.5u  [IND_LPS4012]  8.75,109.5 90 top
L2  [IND_LPS6225]  20.32,107.42 0 top
L3  [IND_LPS6225]  14.75,118 270 top
L4  1.5u  [IND_LPS4012]  10.75,126 0 top
L5  600@100M  [R0805]  48.43,131.81 180 top
L6  600@100M  [R0805]  58.57,131.81 0 top
L7  600@100M  [R0805]  67.41,108.93 90 top
L8  600@100M  [R0805]  50.43,101.97 90 top
L9  600@100M  [R0805]  37.75,109.75 270 top
L10  ???  [R0805]  21.48,51.72 270 top
L11  600@100M  [R0805]  6.75,60.3 270 top
L12  1u  [R0603]  56.36,33.74 0 top
L13  ???  [R0805]  14.03,95.81 270 top
LED1  RED  [LED_HAND]  10,87.38 270 top
LED2  RED  [LED_HAND]  18,87.38 270 top
LED3  RED  [LED_HAND]  26,87.38 270 top
OSC1  OSCILLATOR2.5X2.0MM  [CRYSTAL_2.5X2.0MM]  68.5,86.25 180 top
OSC2  [OSCILLATOR_3.2X2.5]  52.57,32.56 0 top
OSC3  XOSC_2.5X2.0MM  [CRYSTAL_2.5X2.0MM]  51.54,91.21 270 top
OUT  BNC  [BNC_RA]  73.69,11.05 180 top
OUT1  [7395-02]  73.69,8.96 0 top
PDI  [MA03-2]  65.96,32.37 180 top
R1  180k  [R0402]  72.48,134.42 270 top
R2  180k  [R0402]  74.31,134.42 270 top
R3  10k  [R0402]  78.03,134.42 90 top
R4  10k  [R0402]  76.18,134.42 90 top
R5  6.04  [R0402]  11.75,108.5 270 top
R6  63.4k  [R0402]  26.21,109.05 270 top
R7  3.57k  [R0402]  28.25,109.04 270 top
R8  8.45k  [R0402]  31.75,113.5 0 top
R9  100k  [R0402]  44.04,52.08 0 top
R10  2.8k  [R0402]  28.75,122.5 270 top
R11  150k  [R0402]  72.48,142.45 270 top
R12  54.9k  [R0402]  30.75,122.5 270 top
R13  5.76k  [R0402]  31.75,118 180 top
R14  215k  [R0402]  74.31,142.45 270 top
R15  10k  [R0402]  78.03,142.45 90 top
R16  10k  [R0402]  76.18,142.45 90 top
R17  5.36  [R0402]  10.75,129 180 top
R18  2.49k  [0207/12]  47.5,106.25 90 top
R19  3.16k  [R0402]  66.95,38.19 90 top
R20  100k  [R0402]  65.75,103 90 top
R21  2.21k  [0207/12]  114.75,98 270 top
R22  2.80k  [0207/12]  117.75,98 90 top
R23  2k  [0207/12]  87,138.5 90 top
R24  806  [0207/12]  88,125 180 top
R25  806  [0207/12]  88,101.5 180 top
R26  2k  [0207/12]  87,115.25 90 top
R27  100  [0207/12]  90,138.5 90 top
R28  100  [0207/12]  90,115.25 90 top
R29  2.0k  [0207/12]  93,138.5 90 top
R30  2.0k  [0207/12]  93,115.25 90 top
R31  681  [0207/12]  115.5,132.5 90 top
R32  681  [0207/12]  115.5,118 270 top
R33  226  [0207/12]  127.87,138.85 0 top
R34  226  [0207/12]  112.15,107.8 0 top
R35  324  [0207/12]  118.5,132.5 270 top
R36  324  [0207/12]  118.5,118 90 top
R37  100  [0207/12]  127.87,135.5 0 top
R38  332  [0207/12]  142.25,125 270 top
R39  2k  [0207/12]  87,88.5 90 top
R40  806  [0207/12]  88,75 180 top
R41  806  [0207/12]  88,51.5 180 top
R42  2k  [0207/12]  87,65.25 90 top
R43  100  [0207/12]  90,88.5 90 top
R44  100  [0207/12]  90,65.25 90 top
R45  2.0k  [0207/12]  93,88.5 90 top
R46  2.0k  [0207/12]  93,65.25 90 top
R47  681  [0207/12]  115.5,82.25 90 top
R48  681  [0207/12]  115.5,67.75 270 top
R49  226  [0207/12]  127.85,88.6 0 top
R50  226  [0207/12]  112.15,57.62 0 top
R51  324  [0207/12]  118.5,82.25 270 top
R52  324  [0207/12]  118.5,67.75 90 top
R53  100  [0207/12]  127.85,85.5 0 top
R54  332  [0207/12]  142.25,74.5 270 top
R55  3.16k  [R0402]  42.5,89.75 180 top
R56  10k  [R0402]  73.39,69.67 0 top
R57  1k  [R0402]  72.75,67.5 90 top
R58  2050 NA  [R0402]  10.5,36.53 180 top
R59  680 NA  [R0402]  10.48,38.77 180 top
R60  3.16k  [R0402]  69.59,68.54 90 top
R61  100k  [R0402]  53.98,19.23 180 top
R62  3.16k  [R0402]  66.94,41.84 90 top
R63  1k  [R0402]  54.2,26.61 180 top
R64  100 NA  [R0402]  23.54,21.94 0 top
R65  100 NA  [R0402]  20.53,21.94 0 top
R66  68  [R0402]  7.44,20.22 0 top
R67  100k  [R0402]  89.88,26.7 0 top
R68  100k  [R0402]  97.33,26.67 180 top
R69  33  [R0402]  89.56,33.19 180 top
R70  33  [R0402]  98.3,33.08 180 top
R71  3.16k  [R0402]  66.35,68.58 90 top
R72  3.16k  [R0402]  23.68,64.11 180 top
R73  9.76k  [R0402]  23.04,62.09 270 top
R74  9.76k  [R0402]  41.85,87.7 270 top
R75  2050  [R0402]  12.38,87.75 270 top
R76  2050  [R0402]  20.53,87.72 270 top
R77  2050  [R0402]  23.62,87.73 270 top
R78  100k  [R0402]  67,140.5 180 top
R79  100k  [R0402]  66.14,133.12 270 top
R80  3.16k  [R0402]  13,81 180 top
R81  10k  [R0402]  82.22,41.13 180 top
R82  10k  [R0402]  77.04,27.45 180 top
R83  24k  [R0402]  89,39.25 0 top
R84  16k  [R0402]  86,39.25 0 top
R85  24k  [R0402]  83.73,25.54 0 top
R86  16k  [R0402]  80.8,25.54 0 top
R87  100k  [R0402]  62,133.75 0 top
R88  100k  [R0402]  60.21,141.6 0 top
R89  100k  [R0402]  44.5,62 0 top
RUSB1  1M  [R0402]  5.6,86.75 0 top
RUSB2  1M  [R0402]  3.87,54.2 0 top
RX  GREEN NA  [LED_HAND]  14.53,38.77 0 top
STATE  GREEN  [LED_HAND]  7.21,15.51 270 top
SW1  SW1"  [SWITCH_KSS]  2.17,79.88 90 top
TP0  TP  [TP_1]  44,83.25 0 top
TP1  TP  [TP_1]  39.38,83 0 top
TX  RED NA  [LED_HAND]  14.53,36.53 0 top
U$1  [LED_PIPE_7513D2-L]  7.21,10.11 90 top
U$9  [LOGO_6]  126.52,45.05 0 top
USB1  USB_MICRO_B  [ZX62D-B-5P8]  1.94,91.75 270 top
USB2  [240-0002-1]  0.13,47.96 270 top
X1  CON_3.5MM_1X10  [CON_3.5MM_1X10]  107.61,7.95 180 top

## Tracks (layer width: path | path; a pad name or v marks a point on that pad's centre or on a via)
!MCLR  (via drill 0.23 pad 0.53)
  Top 0.203: IC16.15 58.5,70.5 59,70 59,66.5 58.62,66.12 | 58.62,66.12 72.75,66.12 | 72.75,66.12 76.5,66.12 76.75,66.38 JP1.1 | 72.75,66.12 R57.1 | 58.62,66.12 8.75,66.12 v8.5,66.38 | v8.27,76.94 2.19,76.94 SW1.O
  Route3 0.203: v8.5,66.38 8.5,76.71 v8.27,76.94
!SS1  (via drill 0.23 pad 0.53)
  Top 0.203: IC6.P25 61.27,99.71 61.99,99 63.87,99 v64.12,98.75 | v67,76.25 IC16.32
  Route3 0.203: v64.12,98.75 64.12,76.38 64.25,76.25 v67,76.25
!UART_RX  (via drill 0.23 pad 0.53)
  Top 0.203: v22.63,20.75 22.89,21 R64.1 22.63,22.2 22.63,23.44
  Top 0.305: 22.63,23.44 IC27.7
  Bottom 0.203: J2.2 15.69,19.37 16.95,20.62 22.5,20.62
  Bottom 0.305: 22.5,20.62 v22.63,20.75
!UART_TX
  Top 0.203: J2.3 16.99,14.31 17.67,14.31 19.48,16.11 19.48,19.5 21.18,21.21 R65.2 | IC27.6 21.41,22.16
  Top 0.305: 21.41,22.16 R65.2
+5V  (via drill 0.35 pad 0.65)
  Top 0.254: IC20.3 v36.27,52.15 v36.26,52.14 | v40.2,52.14 IC20.1
  Top 0.305: IC20.1 | 22.66,59.58 22.74,59.66 C103.1 23.04,59.77 R73.2
  Top 0.406: IC20.1 39.22,54.53 C115.1 39.21,54.55
  Top 0.508: 39.2,52.16 IC20.1
  Top 0.61: X1.P2 119.86,40.38 118.25,42 113.64,42 JP2.1 113.5,42.1 113.5,47.5 112.75,48.25 77.5,48.25 76.75,49 76.75,56.25 75.75,57.25 38.75,57.25 | 38.75,57.25 23.25,57.25 22.82,57.68 22.82,59.26 22.66,59.58 | 39.21,54.55 39.21,56.79 38.75,57.25 | IC32.P$2 22.44,59.76 C103.1
  Bottom 0.254: v36.26,52.14 v40.2,52.14
+12V  (via drill 0.35 pad 0.6, 0.35 pad 0.65)
  Top 0.203: R2.1 R1.1 72.48,137.35 72.88,137.75 | C5.1 71.1,137.75 72.88,137.75 | C3.2 73.6,137.75 72.88,137.75
  Top 0.406: IC9.7 137.13,125.89 137.5,126.25 C55.1 137.48,127.81 137.48,131.47 C58.+ | IC7.7 106.64,137.63 107,138 C41.1 C45.+ | IC8.7 106.64,114.64 107,115 C49.1 C52.+ | IC10.7 106.64,87.64 107,88 C65.1 C69.+ | IC11.7 106.64,64.63 107,65 C73.1 C76.+ | IC12.7 137.13,75.64 137.5,76 C79.1 C82.+ | R42.2 83.31,71.6 C61.1 C60.+ | R26.2 83.31,121.6 C37.1 C36.+
  Top 0.61: 71.15,138.9 v71.25,139 | C5.1 71.15,136.49 IC1.5
  Top 1.016: v71.25,139 v71.75,139.5 | C5.1 71.15,138.9
  Route3 0.61: v109,140.75 109,120.5 | 109,120.5 109,93.5 | 109,93.5 109,70.65 108.58,70.23 C76.+ | C69.+ 108.48,92.98 109,93.5 | C52.+ 108.48,119.98 109,120.5 | 136,132 v136,140.75 v137,140.75 v138,140.75 | 136,132 136,81.5 136.5,81 137.48,81 C82.+ | C58.+ 136.52,131.48 136,132 | 85.25,94.25 85.25,78.5 84.67,77.92 83.31,77.92 C60.+ | 85.25,94.25 85.25,128.75 | 85.25,128.75 v85.25,140.75 | C36.+ 84.48,127.98 85.25,128.75 | R23.2 85.6,144.85 85.25,144.5 v85.25,140.75 | R39.2 85.85,94.85 85.25,94.25 | v109,140.75 v110,140.75 | C45.+ 108.52,143.48 109,143 v109,140.75 | v85.25,140.75 v84.25,140.75
  Bottom 0.61: v85.25,140.75 v84.25,140.75 v83.25,140.75 | v138,140.75 v136,140.75 | v109,140.75 v108,140.75
  Bottom 1.016: v138,140.75 v110,140.75 v108,140.75 v85.25,140.75 v83.25,140.75 73,140.75 v71.25,139
  pour Route3: 81,77.5 88,77.5 88,146 81,146
  pour Route3: 104.5,65 110.25,65 110.25,146 104.5,146
  pour Route3: 135,79.5 139.5,79.5 139.5,146 135,146
+15V  (via drill 0.35 pad 0.6, 0.35 pad 0.65)
  Top 0.203: L1.1 9.25,107.3 11.55,107.3 11.75,107.5 R5.2 | 67.65,132.9 v67.65,132.7 | 67.5,135.85 IC1.1 v67.65,136.7
  Top 0.254: R6.2 26.21,104.46 25.75,104 9.98,104 v9.68,104.3 9.6,104.38 9.6,105 C4.1
  Top 0.406: IC1.1 C1.1
  Top 0.61: C1.1 64.02,135.7 v64,135.68 | v9.68,104.3 9.68,105.42 C4.1
  Top 0.813: C4.1 9.6,106.95 9.25,107.3
  Route3 0.61: v36.38,135.12 36.38,104 v36.25,103.88
  Bottom 0.203: v67.65,132.7 v67.65,136.7
  Bottom 0.61: v64,135.68 36.93,135.68 v36.38,135.12 | v36.25,103.88 10.1,103.88 v9.68,104.3
-12V  (via drill 0.35 pad 0.65)
  Top 0.203: C15.2 73,145.75 | C16.1 71.15,145.75 73,145.75 | R14.1 R11.1 72.48,145.23 73,145.75
  Top 0.254: v71.73,147.01 71.75,147
  Top 0.406: IC7.4 97.46,135.02 C42.2 97.46,127.79 97.75,127.5 C46.- | IC8.4 97.38,109.08 C50.2 97.46,104.29 97.75,104 C53.- | IC9.4 127.96,123.27 C56.2 127.96,116.04 128.25,115.75 C59.- | IC12.4 127.88,69.83 C80.2 127.96,64.79 128.5,64.25 C83.- | IC11.4 97.38,59.08 C74.2 97.46,54.16 97.91,53.71 98.7,53.71 C77.- | IC10.4 97.38,81.83 C66.2 97.46,76.92 97.94,76.45 98.93,76.45 C70.-
  Top 0.61: C16.1 71.15,144.49 IC3.5
  Top 1.016: 71.15,145.75 v71.15,146.4 71.75,147
  Route3 0.61: C77.- C70.- C53.- C46.- 98.73,146.02 v97.75,147 | C83.- C59.- 129.48,146.02 v129.5,147 v128.5,147
  Bottom 0.203: 129.48,147 v129.5,147 | 130.48,147 v130.5,147 | v98.75,147 v99.75,147
  Bottom 0.61: 99.73,147.02 v98.75,147
  Bottom 1.016: v71.15,146.4 71.75,147 v97.75,147 v98.75,147 v128.5,147 129.48,147 | 130.48,147 v129.5,147
  pour Route3: 95.5,51 101.5,51 101.5,148.5 95.5,148.5
  pour Route3: 126.5,61.5 131.5,61.5 131.5,148.5 126.5,148.5
-15V  (via drill 0.35 pad 0.65)
  Top 0.203: R17.1 12.75,129 12.95,128.8 L4.2 12.95,125.3 13.25,125
  Top 0.254: R12.1 30.75,123.5 30.25,124 16.01,124 15.66,124.35 C17.1
  Top 0.406: C9.1 65.39,142.75 IC3.2
  Top 0.61: v24.75,130 24,129.25 16.25,129.25 15.65,128.65 15.65,125 13.25,125 | v24.79,142.36 25.17,142.75 65.29,142.75 C9.1
  Top 0.813: 15.65,125 C17.1
  Route3 0.61: v24.79,142.36 24.79,130.03 v24.75,130
A5V0  (via drill 0.35 pad 0.6, 0.35 pad 0.65)
  Top 0.406: IC4.2 IC4.1 | R21.2 114.75,95.75 114.5,96 78,96 77.38,96.62 57.5,96.62 57.25,96.38 57.25,95.85 57.01,95.61 v55.67,95.61 v55.67,95.62 | 55.38,95.62 v54.88,95.62
  Top 0.61: v51,99.5 50.5,99.5 | 50.5,99.5 v49.84,99.5 v49.83,99.51 | L8.1 50.43,99.57 50.5,99.5 | v54.88,95.62 v55.67,95.62
  other vias: 51.33,121.28 51.36,119.48 51.33,117.68
  pour Top (no thermals): 53,124.75 53,117.25 51,117.25 51,124.75
  pour Route3: 45.25,126 57.38,126.12 57.38,95 45.25,95
A+3V3
  Top 0.305: IC25.39 L12.1 55.54,33.71 C131.1
ADC0  (via drill 0.23 pad 0.53)
  Top 0.203: v68.72,41.15 66.98,41.15 | R60.1 69.59,67.09 v69.5,67 | v80.25,41.15 80.27,41.13 R81.2 81.57,42.53 C144.2
  Top 0.254: 66.98,41.15 R62.1
  Route3 0.203: v68.72,41.15 68.72,66.85 68.88,67 v69.5,67
  Bottom 0.203: v68.72,41.15 v80.25,41.15
ADC0_EZ  (via drill 0.23 pad 0.53)
  Top 0.203: R60.2 C141.1 69.6,71.9 v69.61,71.8 | v69.4,80.75 IC16.41
  Route3 0.203: v69.61,71.8 69.61,80.54 v69.4,80.75
ADC0_IN  (via drill 0.23 pad 0.53)
  Top 0.203: X1.P7 102.36,38.88 v102,39.25 | v90.75,39.25 R83.2
  Bottom 0.203: v102,39.25 v90.75,39.25
ADC1  (via drill 0.23 pad 0.53)
  Top 0.203: v65.5,37.75 65.71,37.54 R19.1 v66.95,28.5 | R71.1 65.43,67.93 v65.25,67.75 | 76.39,28.86 C145.2 | 76.39,28.86 76.5,28.75 | 76.39,28.25 v75.5,28.25 | R82.2 76.39,28.25 | 76.39,28.25 76.39,28.86
  Route3 0.203: v65.5,37.75 65.25,38 v65.25,67.75
  Bottom 0.203: v75.5,28.25 67.2,28.25 v66.95,28.5
ADC1_EZ  (via drill 0.23 pad 0.53)
  Top 0.203: R71.2 C142.1 66.35,72.51 66.59,72.75 v70.75,72.75 | IC16.42 70.75,81.25 v71,81
  Route3 0.203: v71,81 71,73 v70.75,72.75
ADC1_IN  (via drill 0.23 pad 0.53)
  Top 0.203: X1.P6 105.86,25.23 v105.55,25.54 | v85.44,25.53 R85.2
  Bottom 0.203: v105.55,25.54 85.69,25.54 v85.44,25.53
ALE  (via drill 0.23 pad 0.53)
  Top 0.203: IC16.11 56.5,67.38 56.25,67.12 11.75,67.12 v11.5,67.38 | v11.75,75.25 IC13.P17
  Route3 0.203: v11.5,67.38 11.5,75 v11.75,75.25
AUDIO  (via drill 0.23 pad 0.53)
  Top 0.203: IC16.86 v47.25,80.25
  Top 0.254: R76.2 v20.53,86.25
  Route3 0.254: v20.53,86.25 v20.53,80.47
  Bottom 0.254: v47.25,80.25 20.75,80.25 v20.53,80.47
BUSY  (via drill 0.23 pad 0.53)
  Top 0.203: IC13.P7 15,80.25 v14.75,80.5 14.25,81 R80.1 | IC16.16 59,72.5 v58.75,72.75
  Route3 0.203: v14.75,80.5 14.75,84.75 v15,85 | v57.5,85 57.5,72.88 57.62,72.75 v58.75,72.75
  Bottom 0.203: v57.5,85 v15,85
CE  (via drill 0.23 pad 0.53)
  Top 0.203: IC13.P9 14.5,79.25 v14.25,79 | IC16.79 48.25,83.75 48,84 48,85.25 v47.75,85.5
  Route3 0.203: v14.25,79 14.25,85.25 v14.5,85.5
  Bottom 0.203: v47.75,85.5 v14.5,85.5
CLE  (via drill 0.23 pad 0.53)
  Top 0.203: IC13.P16 10.75,75.75 v10.5,76 | IC16.80 47.5,83.25 47.25,83.5 v47.25,84.5
  Route3 0.203: v10.5,76 10.5,84.25 v10.75,84.5
  Bottom 0.203: v47.25,84.5 v10.75,84.5
CLK_IN  (via drill 0.23 pad 0.53)
  Top 0.203: CLKIN.4 14.16,28.52 v14.85,29.2 | IC22.2 v74.79,29.41
  Bottom 0.203: v14.85,29.2 74.59,29.2 v74.79,29.41
CLK_SYNC  (via drill 0.23 pad 0.53, 0.23 pad 0.6)
  Top 0.203: IC22.4 75.74,47.13 v74.98,47.9 | v61.5,48 59.73,48 IC25.12
  Top 0.254: IC25.12
  Bottom 0.203: v74.98,47.9 61.6,47.9 v61.5,48
CTS  (via drill 0.23 pad 0.6)
  Top 0.203: IC25.29 42.18,41.68 v41.75,41.25 | v41.3,38.58 38.32,38.58
  Top 0.254: 38.32,38.58 IC21.11
  Bottom 0.203: v41.75,41.25 41.75,39.03 v41.3,38.58
D5V  (via drill 0.23 pad 0.53)
  Top 0.203: IC18.3 35.98,90.48 v36,90.5 | v36,87 36,87.76 IC18.1 | R74.2 41.85,86.52 v41.83,86.62
  Top 0.406: IC14.P$2 38.48,89.78 C85.1 37.98,89.69 37.98,87.98 C87.1 38.18,87.78 IC18.1
  Bottom 0.203: v36,90.5 v36,87 36.5,86.5 41.7,86.5 v41.83,86.62
D5V0  (via drill 0.35 pad 0.6, 0.35 pad 0.65)
  Top 0.61: v66.92,106.5 67.5,106.5 | 67.5,106.5 v68,106.5 | L7.1 67.41,106.59 67.5,106.5
  other vias: 63.42,121.25 63.42,119.5 63.42,117.65
  pour Top (no thermals): 65,124.75 65,117.25 63,117.25 63,124.75
  pour Route3 (rank 2): 78,126 78,102.5 58,102.5 58,126
D+  (via drill 0.23 pad 0.53)
  Top 0.203: IC16.55 v61.5,89.25 | v14.5,91.12 11.46,91.12
  Top 0.254: 11.46,91.12 IC15.P$4
  Route3 0.203: v61.5,89.25 v61.5,94.12
  Bottom 0.203: v14.5,91.12 30.5,91.12 30.62,91.25 30.62,93.88 30.88,94.12 v61.5,94.12
D-  (via drill 0.23 pad 0.53)
  Top 0.203: IC15.P$6 10.15,93.01 9.9,92.76 9.9,90.61 v10.18,90.33 | IC16.54 62,90.12 v62.75,90.88
  Route3 0.203: v62.75,90.88 62.75,93.4 62.65,93.5 v62.6,93.5
  Bottom 0.203: v62.6,93.5 31.5,93.5 31.25,93.25 31.25,90.75 31,90.5 10.35,90.5 v10.18,90.33
DAC_!RST  (via drill 0.23 pad 0.53)
  Top 0.203: IC6.P23 59.98,101.47 v59.98,101.25 | IC16.65 v56.5,89.25 | R20.1 v65.75,101.25
  Route3 0.203: v59.98,101.25 56.75,101.25 56.5,101 v56.5,89.25
  Bottom 0.203: v65.75,101.25 v59.98,101.25
EN_DCDC  (via drill 0.23 pad 0.53)
  Top 0.203: IC2.11 28.83,118.92 29.25,118.5 v29.25,112.48 28.83,112.06 27.8,112.06 27.52,112.34 IC2.9 | IC25.24 v43.37,45.68 | v43.12,58 31,58 v30.75,58.25 | R9.1 v43.39,53.11 v43.38,53.12
  Route3 0.203: v29.25,98.62 29.25,112.5 29.27,112.48 v29.25,112.48 | v30.75,79.25 v30.75,58.25 | 43.38,52.62 43.38,45.91 v43.37,45.68 | v19.25,98.25 19.25,79.75 v19.38,79.5 | v43.12,58 43.38,57.75 v43.38,53.12 43.38,52.62 | 43.38,52.62 43.39,52.62
  Bottom 0.203: v29.25,98.62 29,98.38 19.38,98.38 v19.25,98.25 | v19.38,79.5 30.5,79.5 v30.75,79.25
EN_IN0  (via drill 0.23 pad 0.53)
  Top 0.203: IC26.6 35.24,26.37 v35.88,25.73 | v48.22,25.33 48.22,21.26 48.66,20.82 53.66,20.82
  Top 0.305: 53.66,20.82 IC24.1
  Bottom 0.203: v35.88,25.73 47.82,25.73 v48.22,25.33
EN_N12V  (via drill 0.23 pad 0.53)
  Top 0.203: IC16.77 48.62,84.75 48.5,84.88 48.5,85.62 48.12,86 v45.38,86 | v59.4,139.62 59.4,141.44 R88.1
  Route3 0.203: v44.12,139.62 44.12,86.25 44.38,86 v45.38,86
  Bottom 0.203: v44.12,139.62 v59.4,139.62
EN_P12V  (via drill 0.23 pad 0.53)
  Top 0.203: v45.88,86.62 49.12,86.62 49.5,86.25 IC16.76 | R87.1 v60.25,133.75
  Route3 0.203: v44.62,133.62 44.62,86.88 44.88,86.62 v45.88,86.62
  Bottom 0.203: v60.25,133.75 44.75,133.75 v44.62,133.62
FILTB
  Top 0.305: IC6.P16 55.42,100.24 C32.1
  Top 0.61: C32.1 55.23,98.15 C28.+
FT_CTS  (via drill 0.23 pad 0.53)
  Top 0.203: IC21.6 31.66,38.59 v31.5,38.75 | v31.08,42.9 26.11,42.9
  Top 0.254: 26.11,42.9 IC19.11
  Top 0.305: 26.09,42.88 IC19.11
  Bottom 0.203: v31.5,38.75 31.5,42.48 v31.08,42.9
FT_RTS  (via drill 0.23 pad 0.53)
  Top 0.203: IC21.4 28.38,41.13 v28,40.75 | v27.73,37.66 IC19.3
  Top 0.254: IC19.3
  Top 0.305: IC19.3
  Bottom 0.203: v28,40.75 28,37.93 v27.73,37.66
FT_RXD
  Top 0.203: IC21.5 28.43,39.86 27.53,38.96 IC19.5
  Top 0.254: IC19.5
  Top 0.305: 26.12,38.93 IC19.5
  Top 0.406: 26.09,38.96 IC19.5
FT_TXD  (via drill 0.23 pad 0.53)
  Top 0.203: IC21.3 31.15,42.4 v30.75,42 | v27.91,36.34 26.1,36.34
  Top 0.254: 26.1,36.34 IC19.1
  Bottom 0.203: v30.75,42 30.75,36.85 30.25,36.34 v27.91,36.34
GND  (via drill 0.23 pad 0.53, 0.35 pad 0.65)
  Top 0.203: IC2.6 v25.56,112 | 25.25,122.68 v25.21,122.68 v25.2,122.67 | C12.2 C7.2 | IC2.4 24.26,112.51 v24.52,112
  Top 0.406: IC2.15 25.56,122.37 25.25,122.68 | C16.2 69.45,143.98 69.16,143.7 | IC3.1 | IC25.8
  Top 0.508: 34.75,88.75 37.25,88.75
  Top 0.61: IC1.2 69.5,134.75 | 69.16,143.7 IC3.1 | IC4.4 55.16,126.84 55,127 50.07,127 C24.1 | IC5.4 67.16,126.84 67,127 62.03,127 C25.1
  Top 0.864: C14.2 25.25,122.68 26.72,122.68
  other vias: 40.14,47.62 42.36,46.12 33.05,26.33 108.52,25.58 78.07,22.26 55.51,40.08 53.8,44.15 55.65,46.17 53.43,39.05 65.94,44.89 57,20.79 72.54,22.28 116.88,32.57 109.72,32.64 53.9,53.1 49.81,54.09 18.95,30.19 5.16,22.54 11.29,22.57 42.71,28.44 31.29,30.16 44.83,20.97 50.42,31.13 115.58,25.52 86.09,28.59 91.74,26.7 95.38,26.65 95.01,28.49 100.16,28.07 68.16,43.06 50.5,21.79 19.25,112.5 19.25,113.5 20.25,113.5 20.25,112.5 21.25,112.5 19.25,114.5 20.25,115.5 21.25,115.5 21.25,114.5 19.25,115.5 20.25,114.5 21.25,113.5 23.75,115 23.75,116 23.75,117 24.75,117 24.75,116 24.75,115 25.75,115 26.75,115 26.75,116 25.75,116 25.75,117 26.75,117 25.96,122.67 18.25,112.5 18.25,113.5 18.25,114.5 18.25,115.5 8,116 17.25,112.5 16.25,112.5 66,138.75 77.96,136.46 65,138.75 69.29,138.93 70.12,138.93 77.96,144.46 69.32,146.93 70.17,146.93 64.88,145.69 65.88,145.69 45.13,39.97 59.36,31.21 58.64,30.34 54.53,30.17 71.97,38.74 73.75,37.21 75.75,37.21 6.72,92.01 44.85,77.11 39.83,78.47 39.83,77.03 44.66,81.74 11.15,77.75 49.68,90.28 58,66.79 70.23,75.41 70.23,78.26 70.36,83.26 57.99,90.78 64.98,107.35 67.49,117.69 67.45,119.51 55.61,117.66 55.6,119.49 52.7,105.25 50.89,106.91 50.85,111.63 65.73,105.35 46.93,98.12 46.93,96.37 6.1,90.43 6.52,105.5 53.9,101.54 67.72,95.32 65.1,95.3 72.23,112.1 75.48,112.1 72.23,108.6 72.23,105.1 72.23,101.6 75.48,108.6 75.48,105.1 75.48,101.6 68.98,101.6 68.98,105.1 68.98,112.1 65.48,112.1 68.98,108.6 60.35,114.22 70.48,124.1 74.23,124.1 70.48,121.1 70.48,117.85 74.23,121.1 74.23,117.85 59.23,121.35 59.23,117.85 46.48,117.6 46.48,121.1 46.48,114.1 53.86,116.16 75.36,56.12 94.86,38.62 94.86,43.62 116.36,19.62 109.86,19.62 100.36,19.62 96.36,19.62 90.86,19.62 64.86,20.62 16.43,69.16 20.43,69.16 24.43,69.16 28.43,69.16 32.93,69.16 37.43,69.16 9.93,69.16 9.93,73.53 9.93,77.28 9.93,81.03 12.43,83.78 36.93,82.16 36.93,83.53 77.43,66.03 66.43,86.53 66.43,88.28 70.43,88.28 68.43,89.03 68.43,84.53 71.43,88.28 50.24,63.21 29.24,64.46 39.8,36.04 36.93,32.44 7,117.25 7,116 7,114.75 35.12,70.3 75.28,72.01 66.92,40.02 67.62,36.34 104.11,19.62 68.64,71.37 68.64,72.12 45.48,128.35 45.48,127.1 56.73,127.1 57.98,127.1 51.73,138.1 55.23,138.1 42.98,134.1 40.23,134.1 40.23,137.85 42.98,137.85 45.73,137.85 40.23,130.35 42.98,130.35 45.73,130.35 40.23,126.35 42.98,126.35 40.23,122.35 42.98,122.35 40.23,118.35 42.98,118.35 40.23,114.35 42.98,114.35 40.23,110.35 42.98,110.35 40.62,106.52 59.73,138.1 35.23,137.85 32.23,137.85 32.23,134.85 29.23,134.85 26.23,134.85 49.16,97.35 4.43,58.03 4.43,60.03 4.43,62.03 4.43,64.03 21.93,61.04 25.49,64.71 25.49,63.71 24.39,58.12 24.4,61.07 15.68,62.28 15.68,61.03 15.68,59.78 17.18,59.78 17.18,61.03 17.18,62.28 15.68,63.53 17.18,63.53 14.18,63.53 12.68,63.53 11.18,63.53 17.18,64.78 15.68,64.78 14.18,64.78 12.68,64.78 11.18,64.78 11.18,62.28 11.18,61.03 9.68,61.03 9.68,62.28 9.68,63.53 9.68,64.78 14.18,57.78 12.68,57.78 9.68,57.53 39.89,104.83 12.68,62.28 14.18,62.28 14.18,61.03 12.68,61.03 12.68,59.78 14.18,59.78 29.18,89.48 38.47,98.43 38.47,99.93 39.72,99.93 39.72,98.43 40.97,98.43 40.97,99.93 42.22,98.43 42.22,99.93 40.97,96.93 42.22,96.93 42.22,95.43 39.72,96.93 38.47,96.93 38.47,95.43 39.72,95.43 40.97,95.43 43.47,99.93 43.47,98.43 43.47,96.93 43.47,95.43 43.47,101.43 42.22,101.43 40.97,101.43 39.72,101.43 38.47,101.43 38.47,102.93 39.72,102.93 40.97,102.93 42.22,102.93 43.47,102.93 52.91,91.22 51.52,92.93 27.68,91.98 23.18,91.98 18.68,91.98 20.93,89.73 16.18,89.73 25.68,89.73 41.92,54.51 77.43,64.41 58.6,114.22 58.6,112.22 60.35,112.22 75.98,91.02 36.47,99.93 36.47,98.43 36.47,101.43 36.47,102.93 44.71,33.92 34.87,58.83 35.34,62 42.49,61.96 42.91,64.43 67.73,130.97 66.97,93.57 50.43,87.28 66.8,82.41 57.26,88.65 51.1,77.24 56.85,72.86 63.86,75.41 66.82,77.85 62.49,85.66 46.68,92.16 66.85,98.72 62.48,95.6 70.17,147.68 69.32,147.68 70.12,139.68 69.29,139.68 32.68,91.98 60.62,36.34 58.16,95.78 59.74,89.08 83.98,39.27 87.35,45.3 81.57,45.22 82.09,31.8 76.43,31.43 78.96,25.58
  pour Top (rank 2): 148.5,3.5 148.5,49.5 78,49.5 78,65 3.5,65 3.5,57 35.75,57 35.75,31.5 0,31.5 0,24 3.5,24 3.5,3.5 87,3.5 87,0 128,0 128,3.5
  pour Top (no thermals): 21.75,118 21.75,114.5 22.45,114.5 22.45,112 15.25,112 15.25,114 5,114 5,118
  pour Bottom: 5,101.5 35,101.5 35,131.5 5,131.5
  pour Top (rank 2): 5,101.5 35,101.5 35,131.5 13.75,131.5 13.75,124.5 27.75,124.5 27.75,103.25 5,103.25
  pour Top (rank 2): 3.5,148.5 68.5,148.5 68.5,126.5 44.75,126.5 44.75,100.75 3.5,100.75 3.5,134 0,134 0,145 3.5,145
  pour Top: 69,139.75 80,139.75 80,131.25 69,131.25
  pour Top: 69,148.5 80,148.5 80,139.75 69,139.75
  pour Top: 36,99.5 36,112.25 44.75,112.25 44.75,99.5
  pour Top (rank 2): 78,126 78,95 45.25,95 45.25,126
  pour Top: 78.5,50 148.5,50 148.5,52 152,52 152,66.5 148.5,66.5 148.5,102.5 152,102.5 152,117 148.5,117 148.5,148.5 69,148.5 69,126.5 78.5,126.5
  pour Bottom: 78.5,50 148.5,50 148.5,52 152,52 152,66.5 148.5,66.5 148.5,102.5 152,102.5 152,117 148.5,117 148.5,148.5 69,148.5 69,126.5 78.5,126.5
  pour Bottom: 69,148.5 80,148.5 80,131.25 69,131.25
  pour Bottom (no thermals): 9.06,136.75 12.44,136.75 arc-90 13,136.19 13,130.75 8.5,130.75 8.5,136.19 arc-90
  pour Top (rank 2): 78,94.5 44.75,94.5 44.75,100.25 3.5,100.25 3.5,99 0,99 0,73.5 3.5,73.5 3.5,65.5 78,65.5
  pour Route3: 11.25,86.5 11.25,131.5 15.88,131.5 arc90 17,132.62 17,141.38 arc90 15.88,142.5 6.12,142.5 arc90 5,141.38 5,132.62 arc90 6.12,131.5 8.5,131.5 8.5,87.25 3.5,82.5 3.5,57 7,57 7,82.25
  pour Route2 (rank 2): 78,94.5 35.75,94.5 35.75,100.25 3.5,100.25 3.5,99 0,99 0,73.5 3.5,73.5 3.5,65.5 78,65.5
  pour Route2 (rank 2): 78,126 78,95 45.25,95 45.25,126
  pour Bottom (rank 2): 78,126 78,95 45.25,95 45.25,126
  pour Bottom (rank 2): 3.5,148.5 68.5,148.5 68.5,126.5 44.75,126.5 44.75,100.75 3.5,100.75 3.5,134 0,134 0,145 3.5,145
  pour Route2: 78.5,50 148.5,50 148.5,52 152,52 152,66.5 148.5,66.5 148.5,102.5 152,102.5 152,117 148.5,117 148.5,148.5 69,148.5 69,126.5 78.5,126.5
  pour Bottom (rank 2): 148.5,3.5 148.5,49.5 78,49.5 78,65 3.5,65 3.5,57 35.75,57 35.75,31.5 0,31.5 0,24 3.5,24 3.5,3.5 87,3.5 87,0 128,0 128,3.5
  pour Bottom (rank 2): 78,94.5 44.75,94.5 44.75,100.25 3.5,100.25 3.5,99 0,99 0,73.5 3.5,73.5 3.5,65.5 78,65.5
  pour Route2 (rank 2): 148.5,3.5 148.5,49.5 78,49.5 78,65 3.5,65 3.5,57 35.75,57 35.75,31.5 0,31.5 0,24 3.5,24 3.5,3.5 87,3.5 87,0 128,0 128,3.5
  pour Route3 (rank 2): 148.5,3.5 148.5,49.5 78,49.5 78,65 6,65 6,57 35.75,57 35.75,31.5 0,31.5 0,24 3.5,24 3.5,3.5 87,3.5 87,0 128,0 128,3.5
  pour Route3 (rank 2): 78.5,50 148.5,50 148.5,52 152,52 152,66.5 148.5,66.5 148.5,102.5 152,102.5 152,117 148.5,117 148.5,148.5 69,148.5 69,126.5 78.5,126.5
  pour Route2 (rank 2): 3.5,148.5 68.5,148.5 68.5,126.5 44.75,126.5 44.75,100.75 3.5,100.75 3.5,134 0,134 0,145 3.5,145
  pour Route3: 57.75,95 78,95 78,102 57.75,102
GND2  (via drill 0.35 pad 0.65)
  Top 0.305: IC17.P$2 14.44,48.36 v14.4,48.32
  other vias: 5.9,55.45 5.9,54.2 5.9,52.95 11.87,53.72 13.84,45.89 4.84,42.39 4.84,40.89 13.17,43.52 15.5,40.25 26.12,46.85 18.91,46.12 30.16,37.23 26.12,50.85 26.12,54.35 30.62,54.35 34.62,54.35 34.62,50.85 30.62,50.85 30.47,47.65 34.62,47.35 31.05,36.04 31.05,33.04 34.05,33.04
  pour Top: 0,56.5 35.25,56.5 35.25,32 0,32
  pour Bottom: 0,56.5 35.25,56.5 35.25,32 0,32
  pour Route2: 0,56.5 35.25,56.5 35.25,32 0,32
  pour Route3: 0,56.5 35.25,56.5 35.25,32 0,32
GNDIO  (via drill 0.35 pad 0.65)
  Top 0.406: IC26.9 v32.7,22.27 32.7,20.83 33.47,20.06 33.47,16.14 35.27,14.34 35.93,14.34 J1.5 | IC26.15 40.32,22.15 v40.33,22.14
  Bottom 0.406: v40.33,22.14 40.33,22.68 39.9,23.11 32.91,23.11 32.7,22.91 v32.7,22.27
IN00/TRIG  (via drill 0.23 pad 0.53)
  Top 0.203: v56.2,26.64 55.57,26 IC24.4 | R63.1 56.18,26.61 | v64.62,26.64 64.88,26.89 64.88,40.75 64.74,40.88 IC25.4 54.99,40.88 v54.88,41 | IC16.71 v53.5,84.5
  Top 0.254: v56.2,26.63 v56.2,26.64 56.18,26.61
  Route3 0.203: v53.5,84.5 53.5,58.38 53.75,58.12 54.62,58.12 54.88,57.88 v54.88,41
  Bottom 0.203: v56.2,26.64 v64.62,26.64
IN1
  Top 0.203: IC30.2 89.25,26.54 89.25,8.25 89.5,8 91.81,8
  Top 0.254: 89.25,26.54 R67.1 | 91.81,8 X1.P10
IN01  (via drill 0.23 pad 0.53, 0.23 pad 0.65)
  Top 0.203: v53,54 53,48.33 | R69.2 v87.66,33.19
  Top 0.254: 53,48.33 IC25.20
  Top 0.305: v87.66,33.19 v87.65,33.19
  Route3 0.203: v70.5,33.5 70.5,54.1 v70.26,54.34
  Bottom 0.203: v70.26,54.34 53.34,54.34 v53,54 | v87.65,33.19 71.06,33.19 v70.5,33.5
IN02  (via drill 0.23 pad 0.53, 0.35 pad 0.6)
  Top 0.203: IC25.10 v65.93,45.68
  Top 0.254: R70.2 v97.64,45.44
  Bottom 0.203: v97.64,45.44 97.08,46 66.25,46 v65.93,45.68
IN2
  Top 0.203: IC31.2 98,26.85 | 98.01,26.64 98.01,11.01 97.75,10.75 95.64,10.75 95.35,10.46 95.35,7.96 X1.P9
  Top 0.254: 98,26.85 R68.1 98.01,26.64
IN_RJ  (via drill 0.23 pad 0.65)
  Top 0.203: v37.79,21.97 IC26.13
  Top 0.305: IC26.13
  Bottom 0.203: v37.79,21.97 36.16,20.33 36.16,16.19 34.82,14.85 34.82,13.82 34,13 31.43,13 30.94,13.49 J1.1
  Bottom 0.305: J1.1
INBK
  Top 0.406: IC2.3 L2.2
  pour Top (no thermals): 24.35,105 24.35,110.38 23.75,111 23.47,111 22.86,110.38 22.85,105
IOUTL+  (via drill 0.23 pad 0.53, 0.35 pad 0.6)
  Top 0.254: IC6.P18 56.73,98.53 57.25,98 v78.75,98 | v79.25,71.5 79.4,71.35 C62.1
  Top 0.305: IC10.2 93.47,87.65 93,87.18 R45.1 R43.1 R39.1 86.99,82.16 80.48,82.16 80,81.68 C62.1
  Route3 0.254: v79.25,71.5 79.25,97.5 v78.75,98
IOUTL-  (via drill 0.23 pad 0.53, 0.35 pad 0.6)
  Top 0.254: IC6.P17 56.08,97.92 56.75,97.25 v78.12,97.25 | C62.2 78.97,69.65 v78.62,70
  Top 0.305: IC11.2 93.64,64.64 93,63.99 R46.1 R44.1 R42.1 80.56,58.9 80,59.45 C62.2
  Route3 0.254: v78.62,70 78.62,96.75 v78.12,97.25
IOUTR+  (via drill 0.35 pad 0.6)
  Top 0.254: IC6.P11 56.73,115.22 57.25,115.75 v76.5,115.75 | v77.77,121.58 79.98,121.58 C38.1
  Top 0.305: IC7.2 93.64,137.63 93,137 R29.1 R27.1 R23.1 80.65,132.15 80,131.5 C38.1
  Bottom 0.254: v76.5,115.75 77.25,116.5 77.25,121.06 v77.77,121.58
IOUTR-  (via drill 0.35 pad 0.6)
  Top 0.254: IC6.P12 56.08,115.83 56.75,116.5 v76,116.5 | C38.2 79.98,119.88 76.95,119.88 v76.5,119.43
  Top 0.305: IC8.2 93.64,114.64 93,114 R30.1 R28.1 R26.1 80.6,108.9 80,109.5 C38.2
  Bottom 0.254: v76,116.5 76.5,117 v76.5,119.43
MEMORY  (via drill 0.23 pad 0.53)
  Top 0.254: IC16.95 v48,75.75 | R75.2 16.65,87.1 v16.75,87
  Route3 0.254: v16.75,87 16.75,76 v17,75.75
  Bottom 0.203: 45.62,75.75 v48,75.75
  Bottom 0.254: v17,75.75 45.62,75.75
MUTE  (via drill 0.23 pad 0.53)
  Top 0.203: IC6.P22 59.33,99.67 59.5,99.5 60.5,99.5 v60.62,99.38 | IC16.57 v60.5,89.25
  Route3 0.203: v60.5,89.25 60.5,99.25 v60.62,99.38
N$1
  Top 0.254: IN1.1 55.91,14.51 54.65,15.78 IN.1 | 54.63,16.29 IN.1 | IC24.2 54.63,20.79 R61.1 54.63,16.14 IN.1
N$2  (via drill 0.23 pad 0.53)
  Top 0.203: R63.2 v52.67,26.61 | v36.52,26.97 IC26.5
  Top 0.254: IC26.5
  Bottom 0.203: v52.67,26.61 36.88,26.61 v36.52,26.97
N$3
  Top 0.254: R74.1 R55.2 41.85,90.33 41.01,91.17 41.01,92.56 IC14.P$4
N$4
  Top 0.203: IC2.7 R6.1 R7.1
N$5  (via drill 0.23 pad 0.53)
  Top 0.254: IC14.P$5 42.86,92.58 v43.12,92.58 | v36.32,92.59 37.2,92.59 IC14.P$1
  Top 0.406: IC14.P$1 37.21,104.57 C90.2
  Top 0.61: C90.2 37.48,106.33 C91.2 37.65,108.7 L9.2
  Bottom 0.254: v43.12,92.58 v36.32,92.58 v36.32,92.59
N$6
  Top 0.203: R82.1 IC38.1 | IC38.1 | IC38.1 79.55,28.3 80,28.75 81.11,28.75 81.45,29.09 IC38.4
N$7
  Top 0.203: R8.2 C7.1
N$8
  Top 0.254: IC30.4 90.2,33.21 R69.1
N$9
  Top 0.203: IC2.8 26.86,111.95 27.16,111.65 30.75,111.65 C8.1 R8.1
N$10
  Top 0.254: IC31.4 98.95,33.33 R70.1
N$11
  Top 0.203: R13.2 C10.1 31.25,119.5 30.75,120 27.75,120 27.51,119.76 IC2.12
N$12
  Top 0.203: C12.1 R13.1
N$13
  Top 0.305: IC2.16 24.91,120.88 C14.1
N$14
  Top 0.203: R4.2 76.18,137.36 75.84,137.7 75.2,137.7 C3.1
N$15
  Top 0.203: IC16.73 52.5,90.3 OSC3.P$3
N$16
  cutout Route2: 3.5,132.25 35.75,132.25 35.75,100.75 3.5,100.75
N$18
  Top 0.203: IC2.13 26.86,119.96 R10.2 R12.2
N$19
  Top 0.203: IC37.1 84.8,42.05 85.25,42.5 86.34,42.5 86.7,42.85 IC37.4 | 84.74,41.25 IC37.1 | R81.1 84.74,41.13 IC37.1
N$20
  Top 0.203: IC25.5 65.44,41.68 65.75,41.38 65.75,39.25 66.16,38.84 R19.2 | C140.1
  Top 0.305: R19.2 C140.1
N$21  (via drill 0.23 pad 0.53)
  Top 0.305: IC32.P$5 v19.79,64.27 v19.78,64.27 | v19.78,57.76 19.78,58.48 IC32.P$1
  Top 0.406: IC32.P$1 C109.2 | C109.2 | C109.2 C110.2 | C110.2 | C110.2 7.61,58.49 L11.2
  Bottom 0.305: v19.78,64.27 v19.78,57.76
N$22
  Top 0.254: C137.1 26.95,121.35 R10.1
  Top 0.305: IC2.14 26.21,120.81 C137.1
N$23
  Top 0.203: R66.1 6.79,16.93 STATE.A
N$24
  Top 0.305: R72.2 R73.1 22.6,62.3 IC32.P$4
N$25
  Top 0.203: 66.98,42.53 R62.2 IC25.6
  Top 0.254: C122.1 66.98,42.53
N$26
  Top 0.203: R1.2 R2.2 R4.1 R3.1 | 72.45,133.81 R1.2 | IC1.4 72.45,133.8 R1.2
N$27
  Top 0.305: IC6.P1 C30.1 67.39,109.9 L7.2
N$28
  Top 0.203: IC3.4 R11.2 R14.2 R16.1 R15.1
N$29
  Top 0.203: R16.2 76.18,145.32 75.75,145.75 C15.1
N$30
  Top 0.305: R24.1 93.5,125 93.04,125.46 C39.1 94.5,129 95,129.5 95,136 95.36,136.37 IC7.3
N$31
  Top 0.305: IC6.P13 55.42,113.03 54.93,113.51 C29.1 51.26,113.51 51.25,113.5 51.25,114.14 C33.+
N$32
  Top 0.305: IC6.P15 54.76,102.58 C31.1 50.77,102.58 L8.2
N$33
  Top 0.203: IC5.3 65.88,121.02 C23.1
N$34
  Top 0.305: R25.1 92.75,101.5 92.54,101.71 C40.1 94.5,105.5 95,106 95,113 95.36,113.36 IC8.3
N$35
  Top 0.254: R18.2 54.29,112.6 54.78,112.11 54.78,109.91 IC6.P14
N$36
  Top 0.254: LED1.A 12.35,88.38
  Top 0.305: 12.35,88.38 R75.1
N$37
  Top 0.203: IC5.5 67.16,130.34 66.75,130.75 64.99,130.75 64.62,130.38 IC5.7
  Top 0.61: IC5.8 63.33,128.85 C25.2 C27.2 59.5,131.79 L6.2
  Top 0.813: IC5.8 IC5.7
  pour Top (no thermals): 57,132.5 64.75,132.5 64.75,128.5 57,128.5
N$38
  Top 0.305: 16.04,43.51 C113.1
  Top 0.356: IC19.17 16.04,43.51
N$39
  Top 0.305: IC17.P$5 20.92,48.36 21.64,49.09 21.64,50.36 21.01,50.99 21.49,50.99 L10.2 | 9.66,49.49 8.83,49.51 USB2.P$1 | C106.1 11.92,51.12
  Top 0.406: 21.01,50.99 11.79,50.99 | 11.79,50.99 11.16,50.99 9.66,49.49 | 11.92,51.12 11.79,50.99
N$40
  Top 0.203: IC17.P$1 14.39,49.31 13.92,48.84 8.87,48.84
  Top 0.305: 8.81,48.78 USB2.P$2 8.87,48.84
N$41
  Top 0.254: IC4.3 53.88,121.02 C22.1
N$42
  Top 0.305: C54.1 127.96,134.96 128.5,135.5 R37.2
N$43
  Top 0.254: IC4.5 55.16,130.34 54.75,130.75 52.98,130.75 52.61,130.38 IC4.7
  Top 0.61: C24.2 51.33,128.85 IC4.8 | C24.2 C26.2 47.48,128.87 L5.2 | C24.2
  Top 0.813: IC4.7 IC4.8